# EAGLE design ZOMGTHEREMINBBQLOL.3 (EAGLE 5.11)

## Sheet 1 of 2
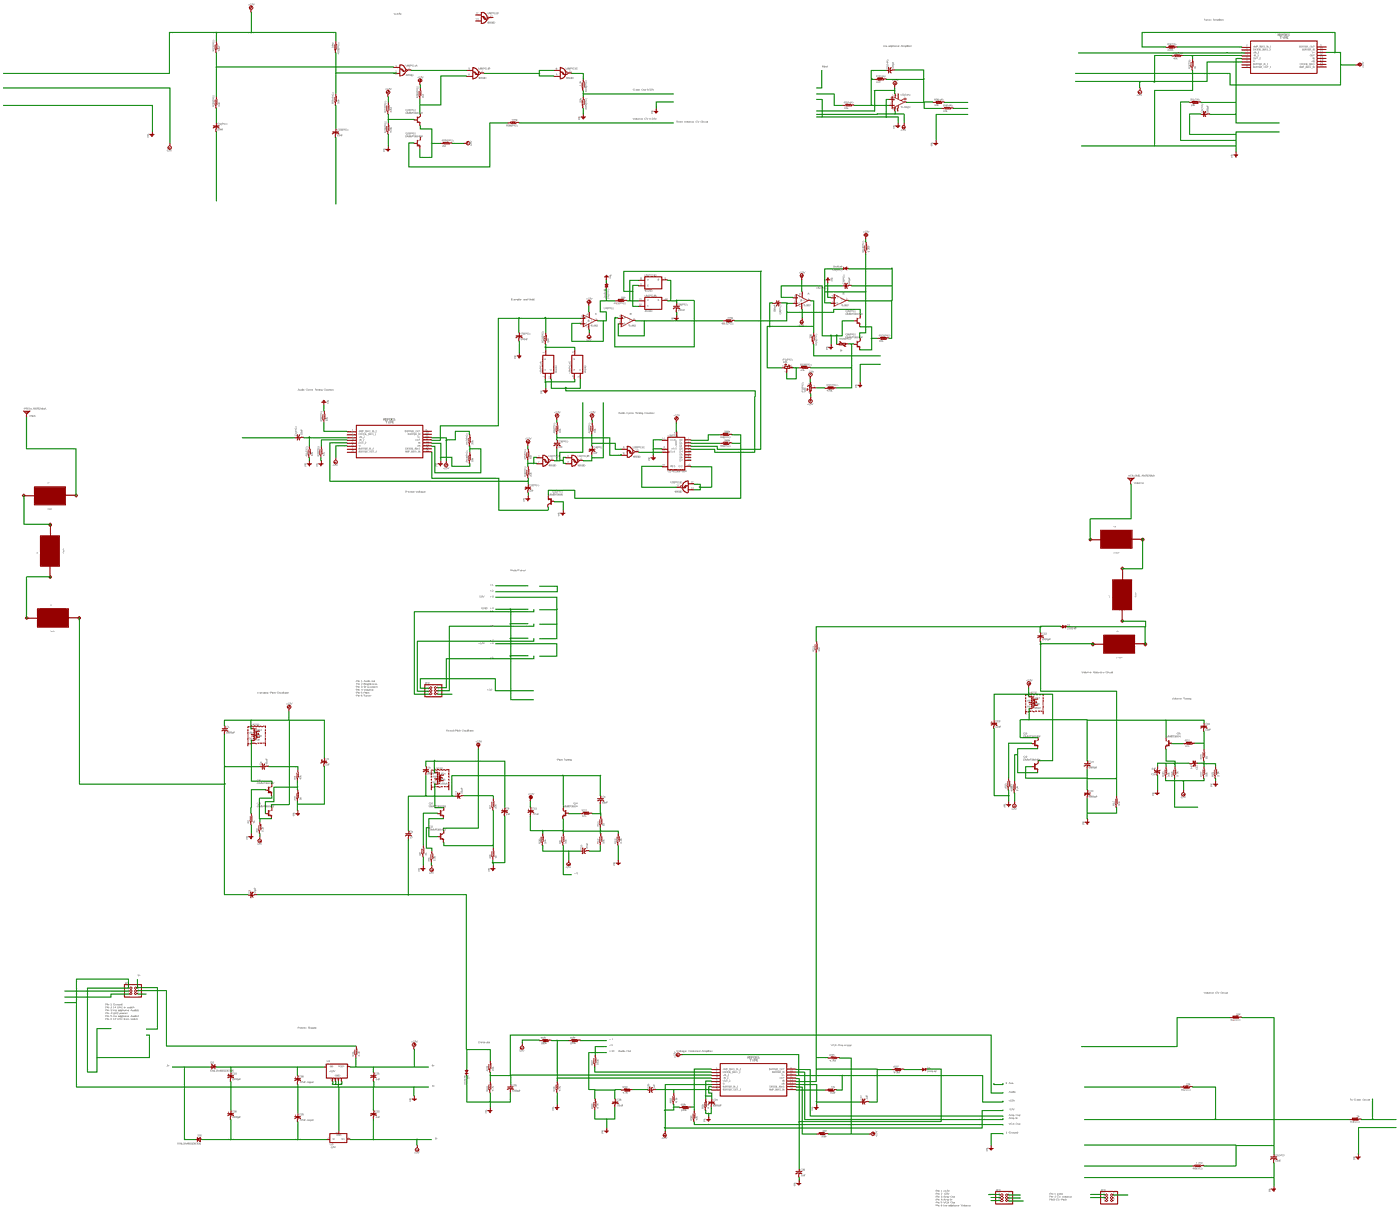
[diagram p0: schematic, sheet 1, overview]
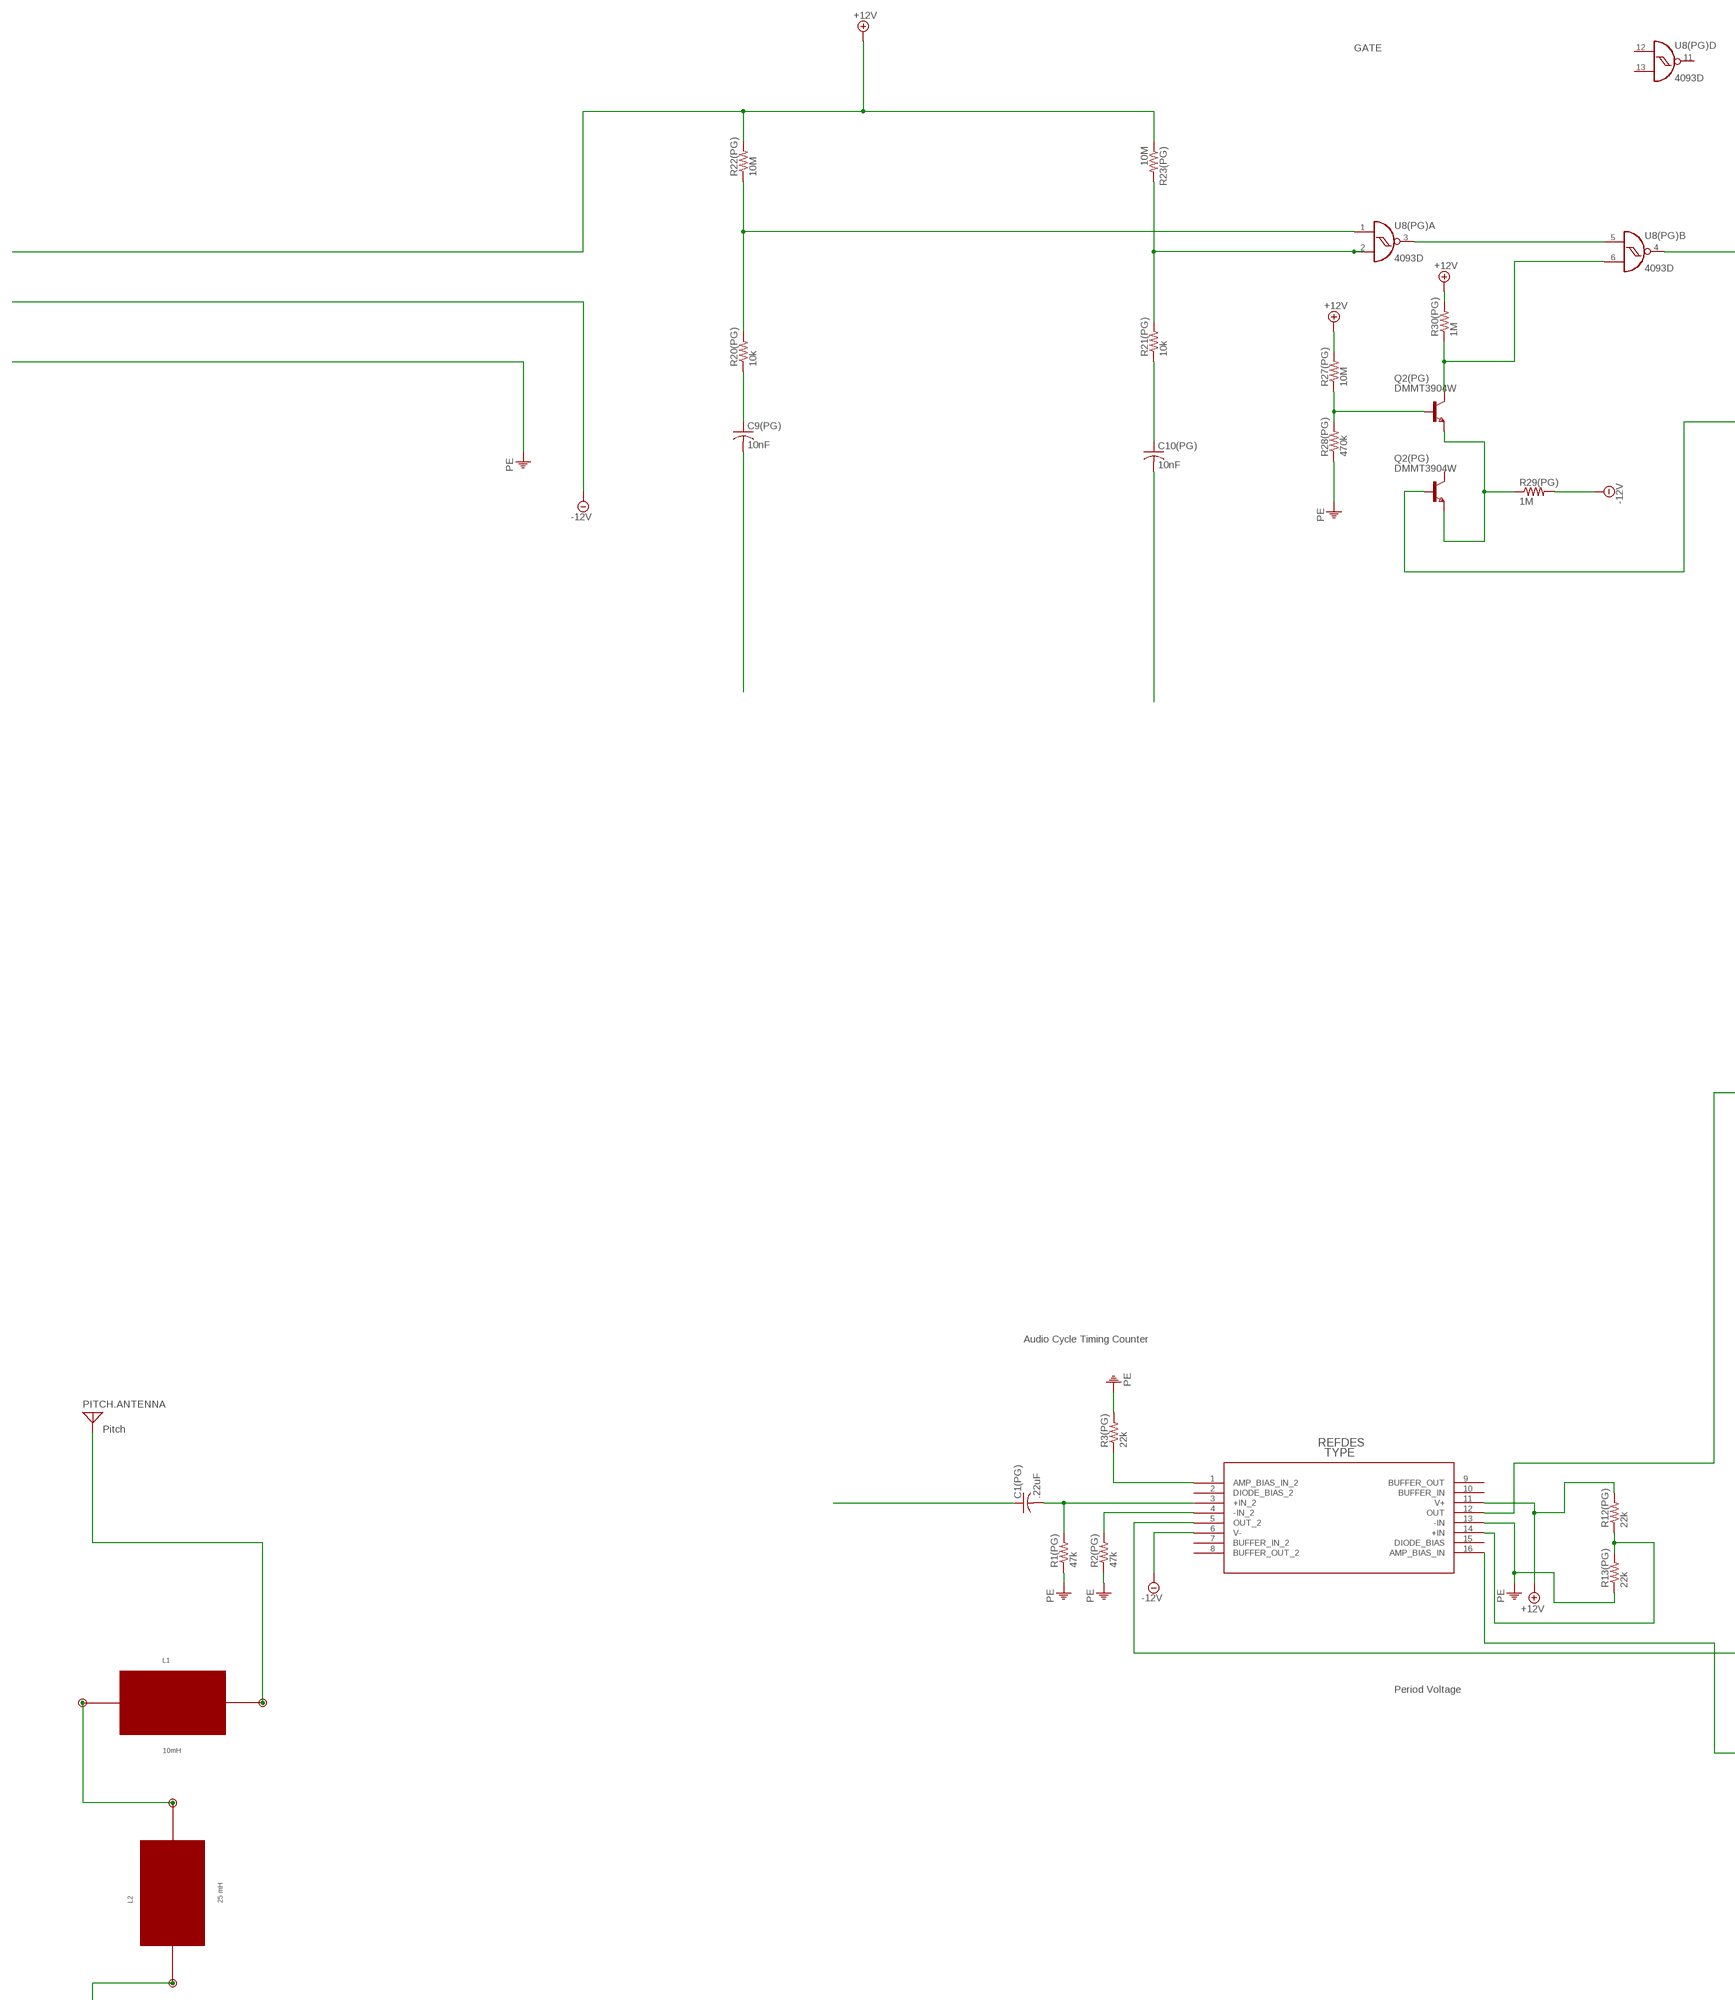
[diagram p1: schematic, sheet 1, part 1 of 6]
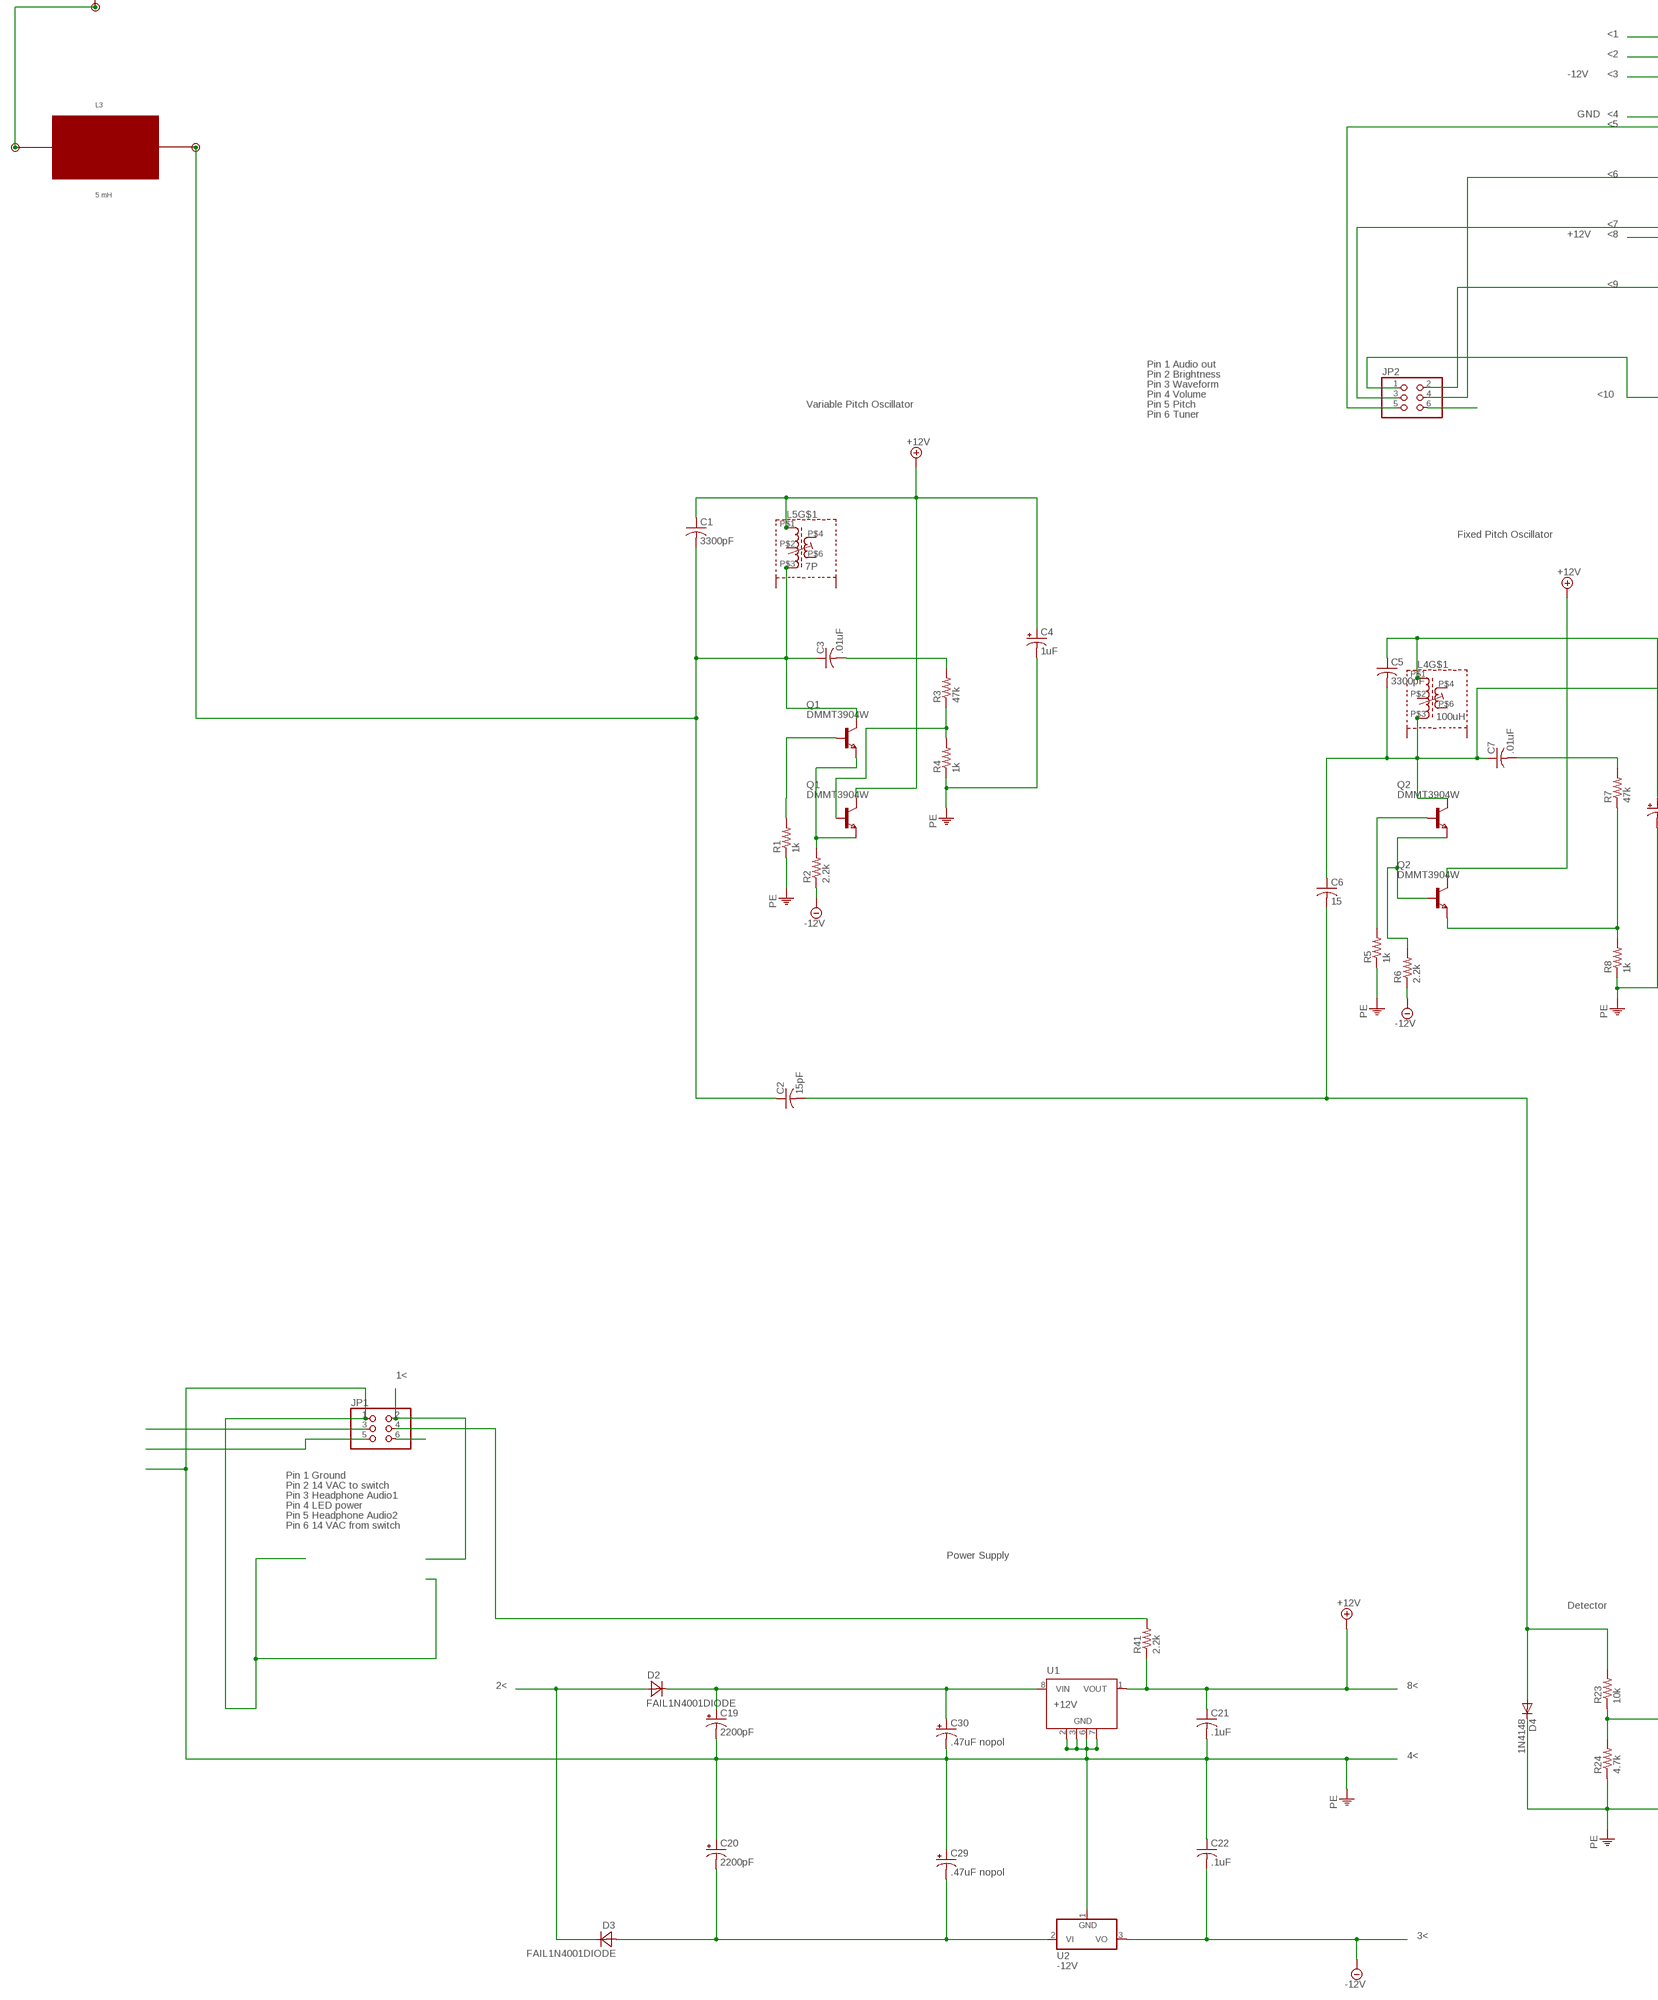
[diagram p2: schematic, sheet 1, part 2 of 6]
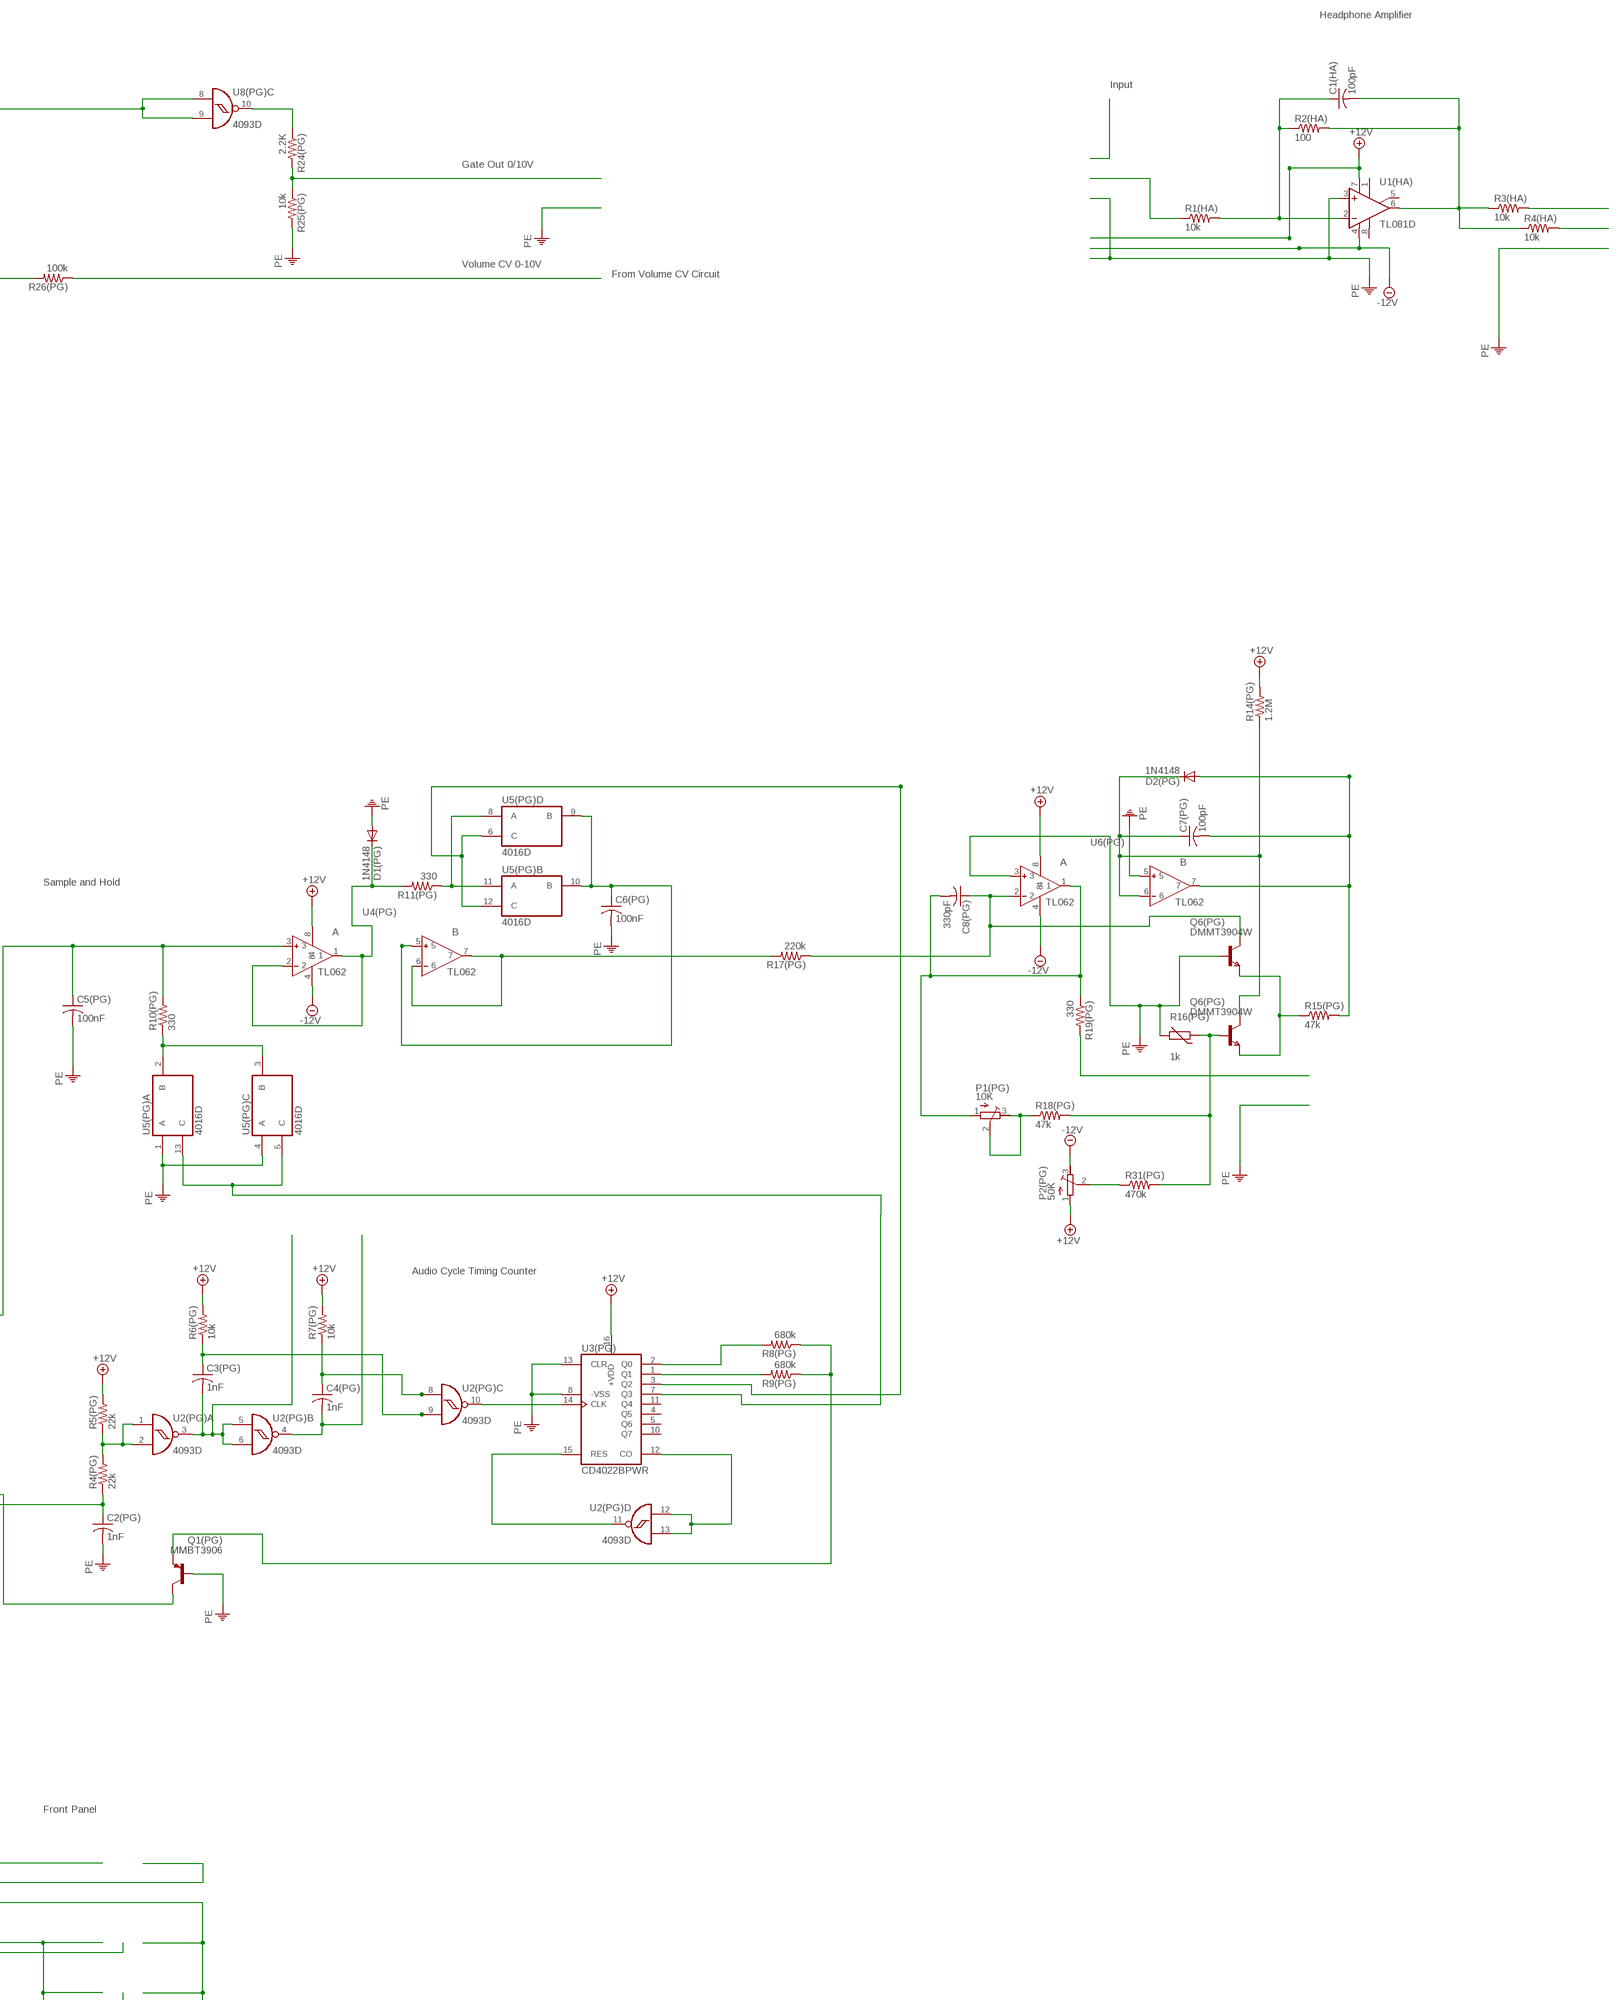
[diagram p3: schematic, sheet 1, part 3 of 6]
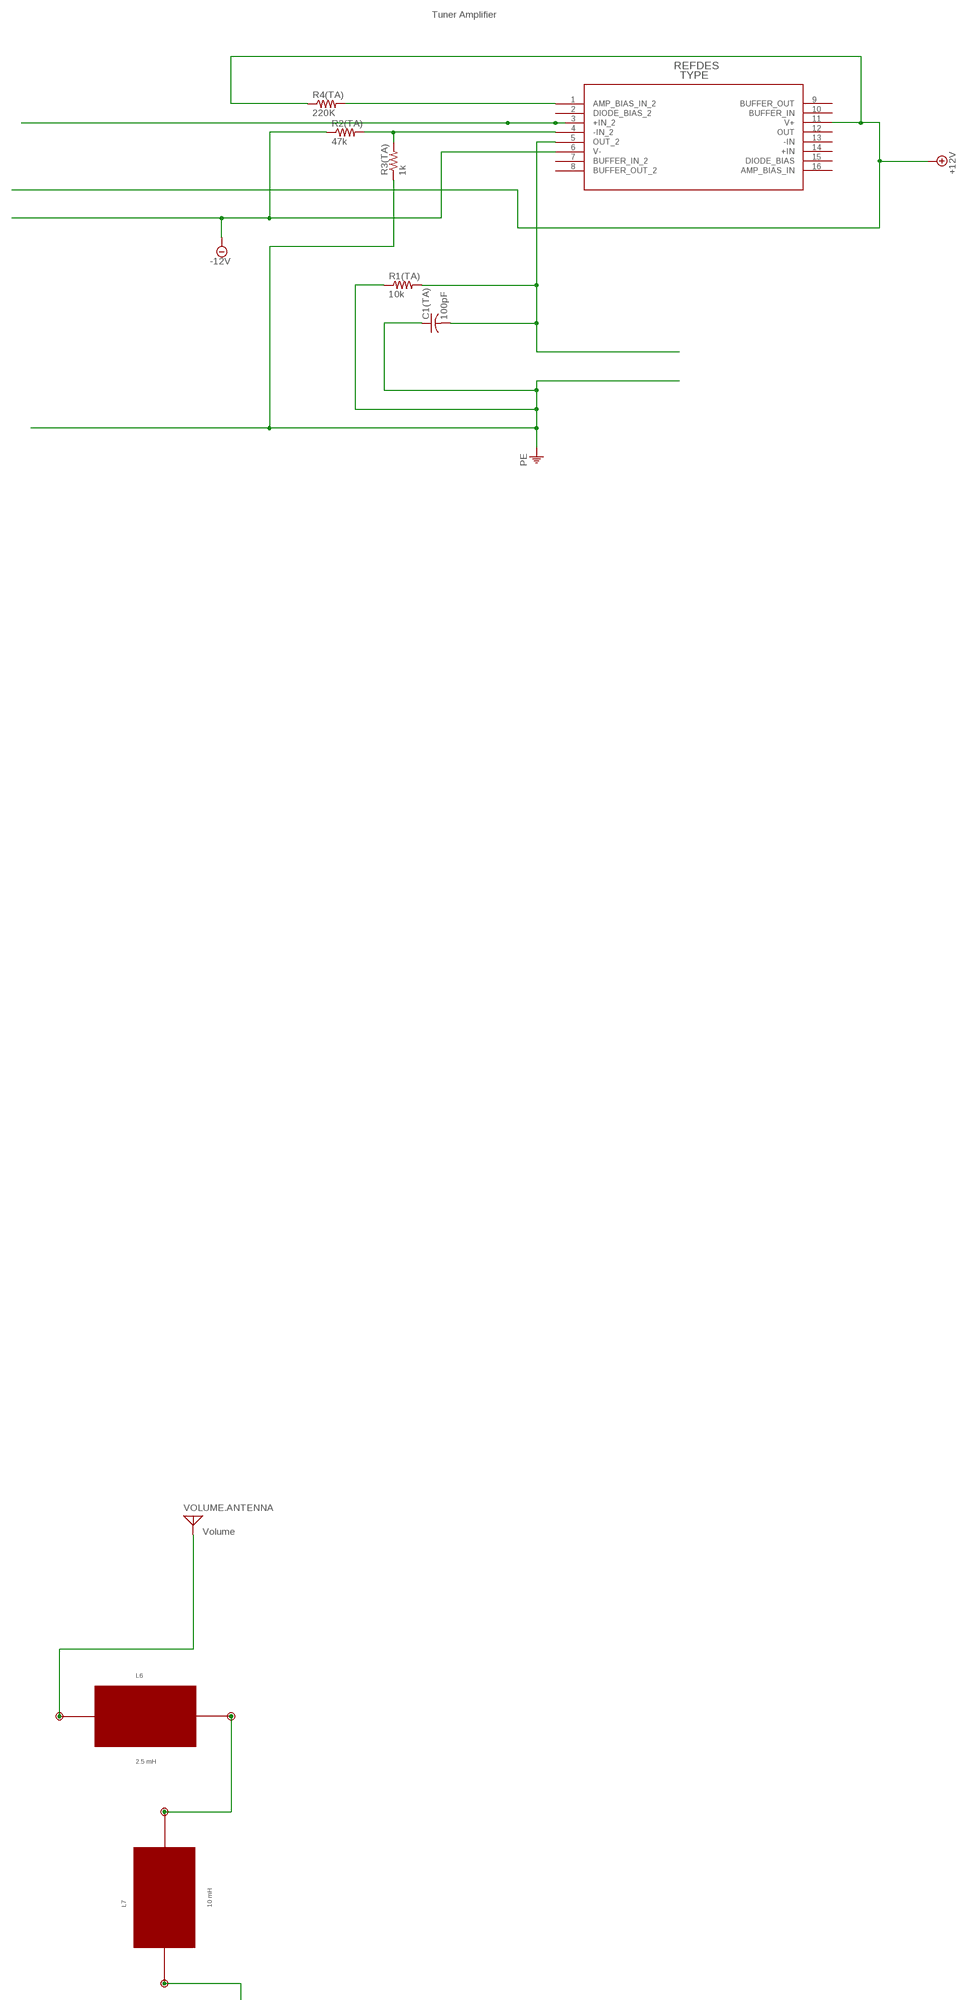
[diagram p4: schematic, sheet 1, part 4 of 6]
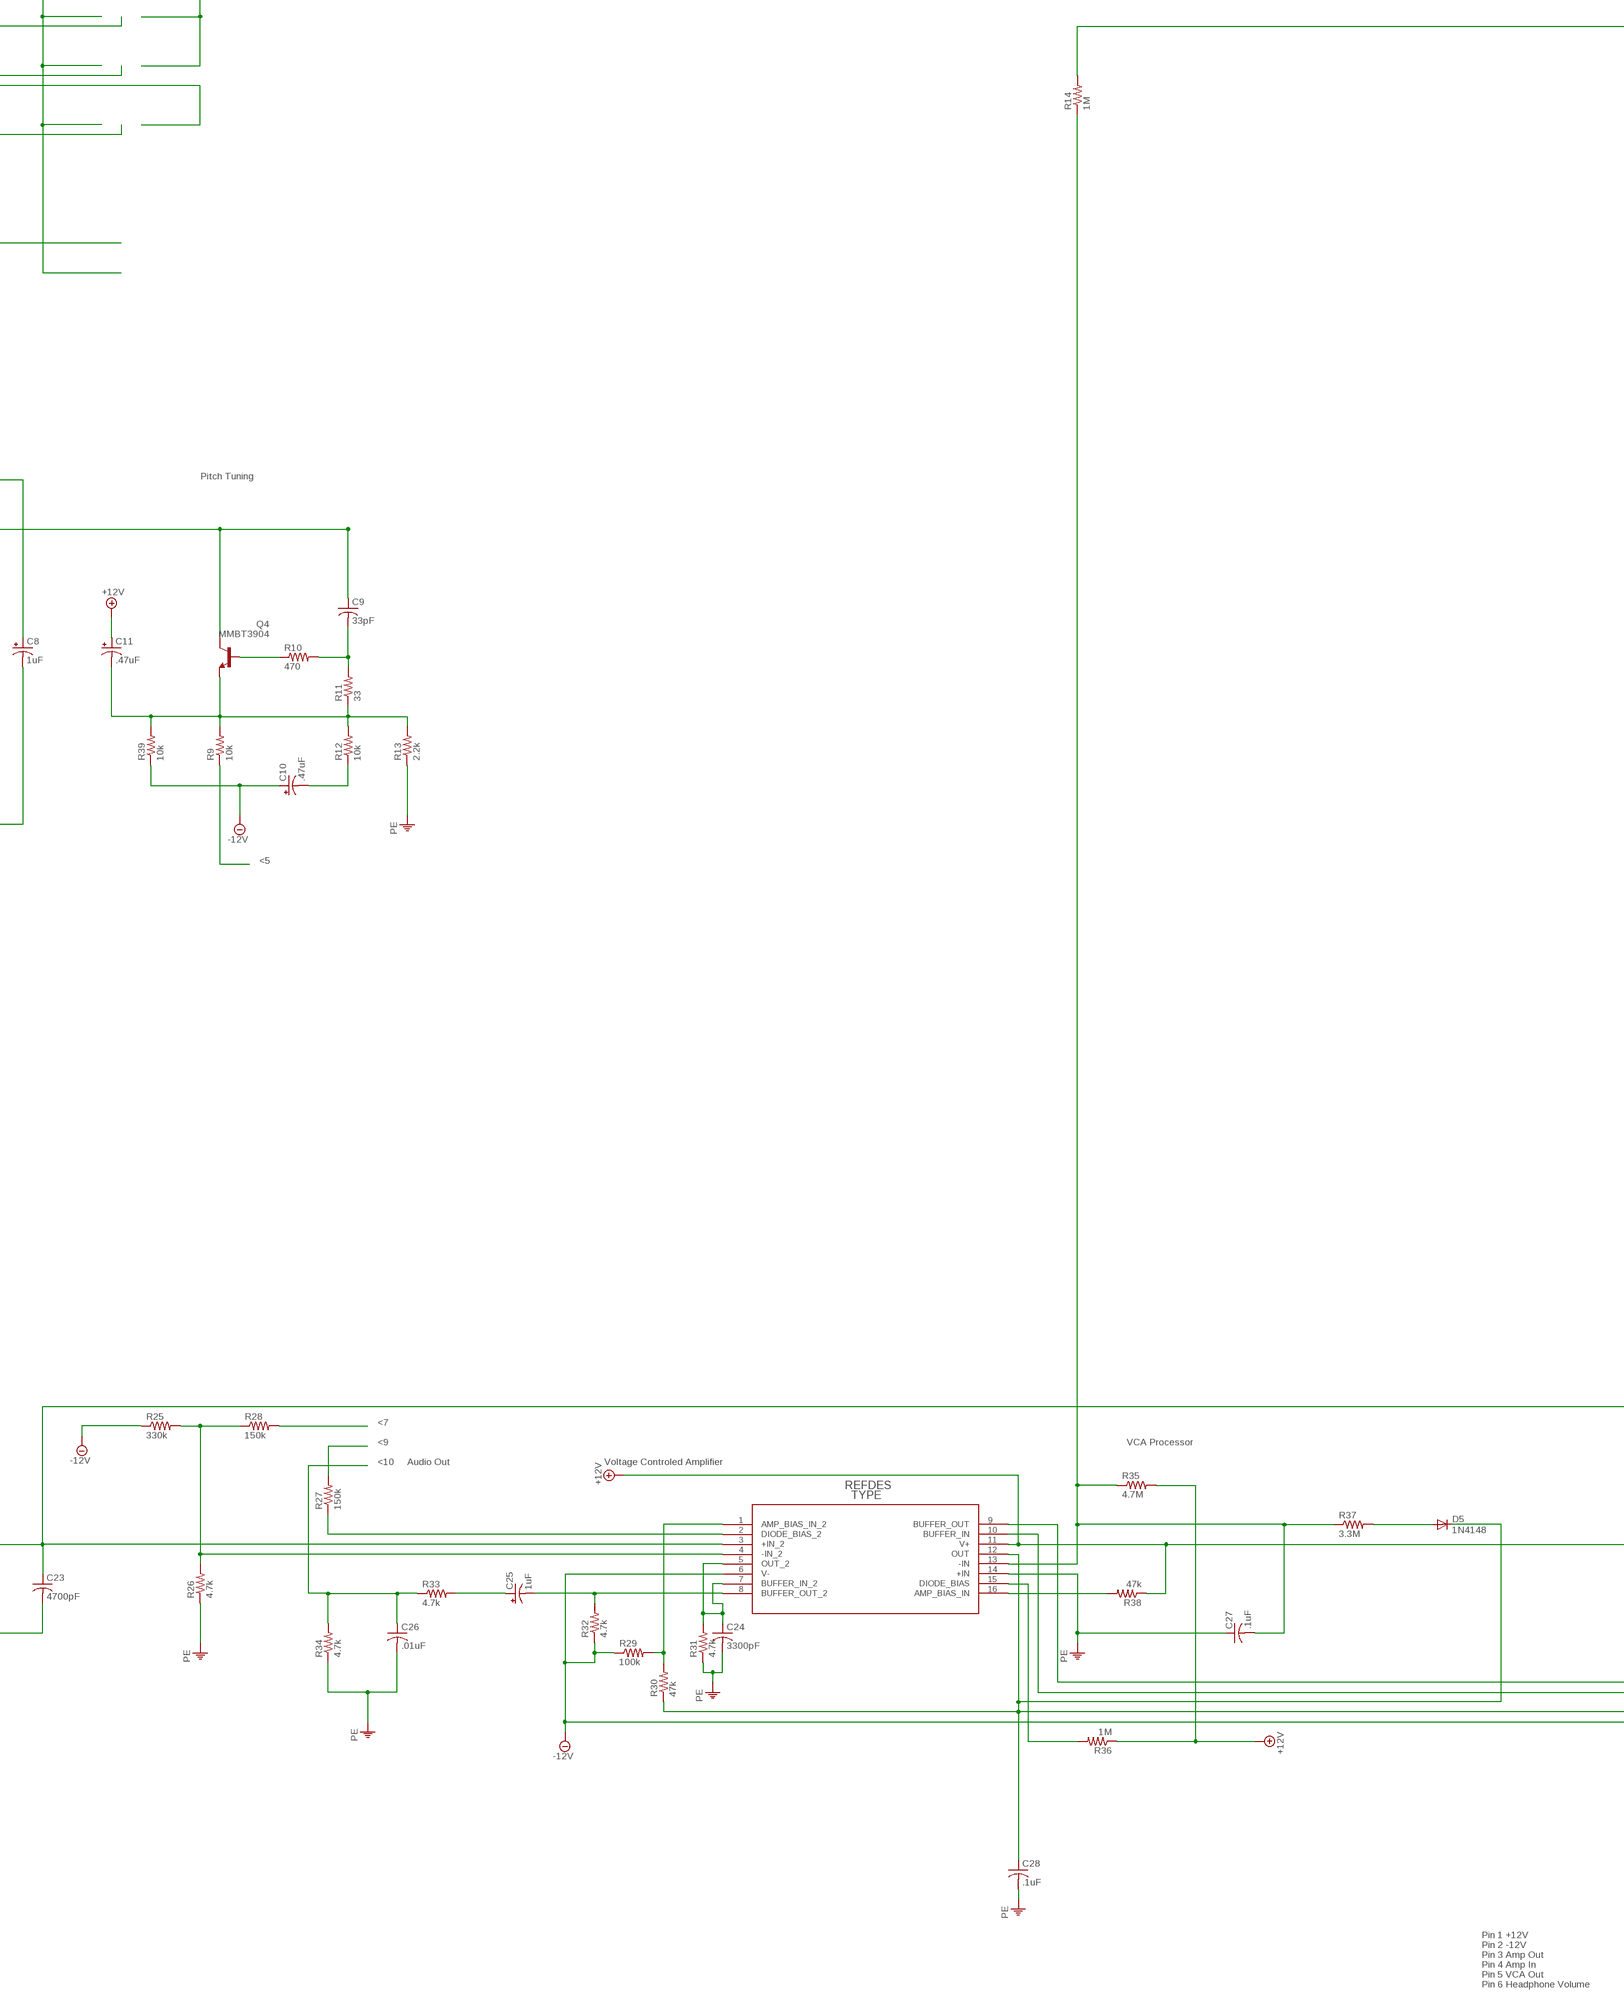
[diagram p5: schematic, sheet 1, part 5 of 6]
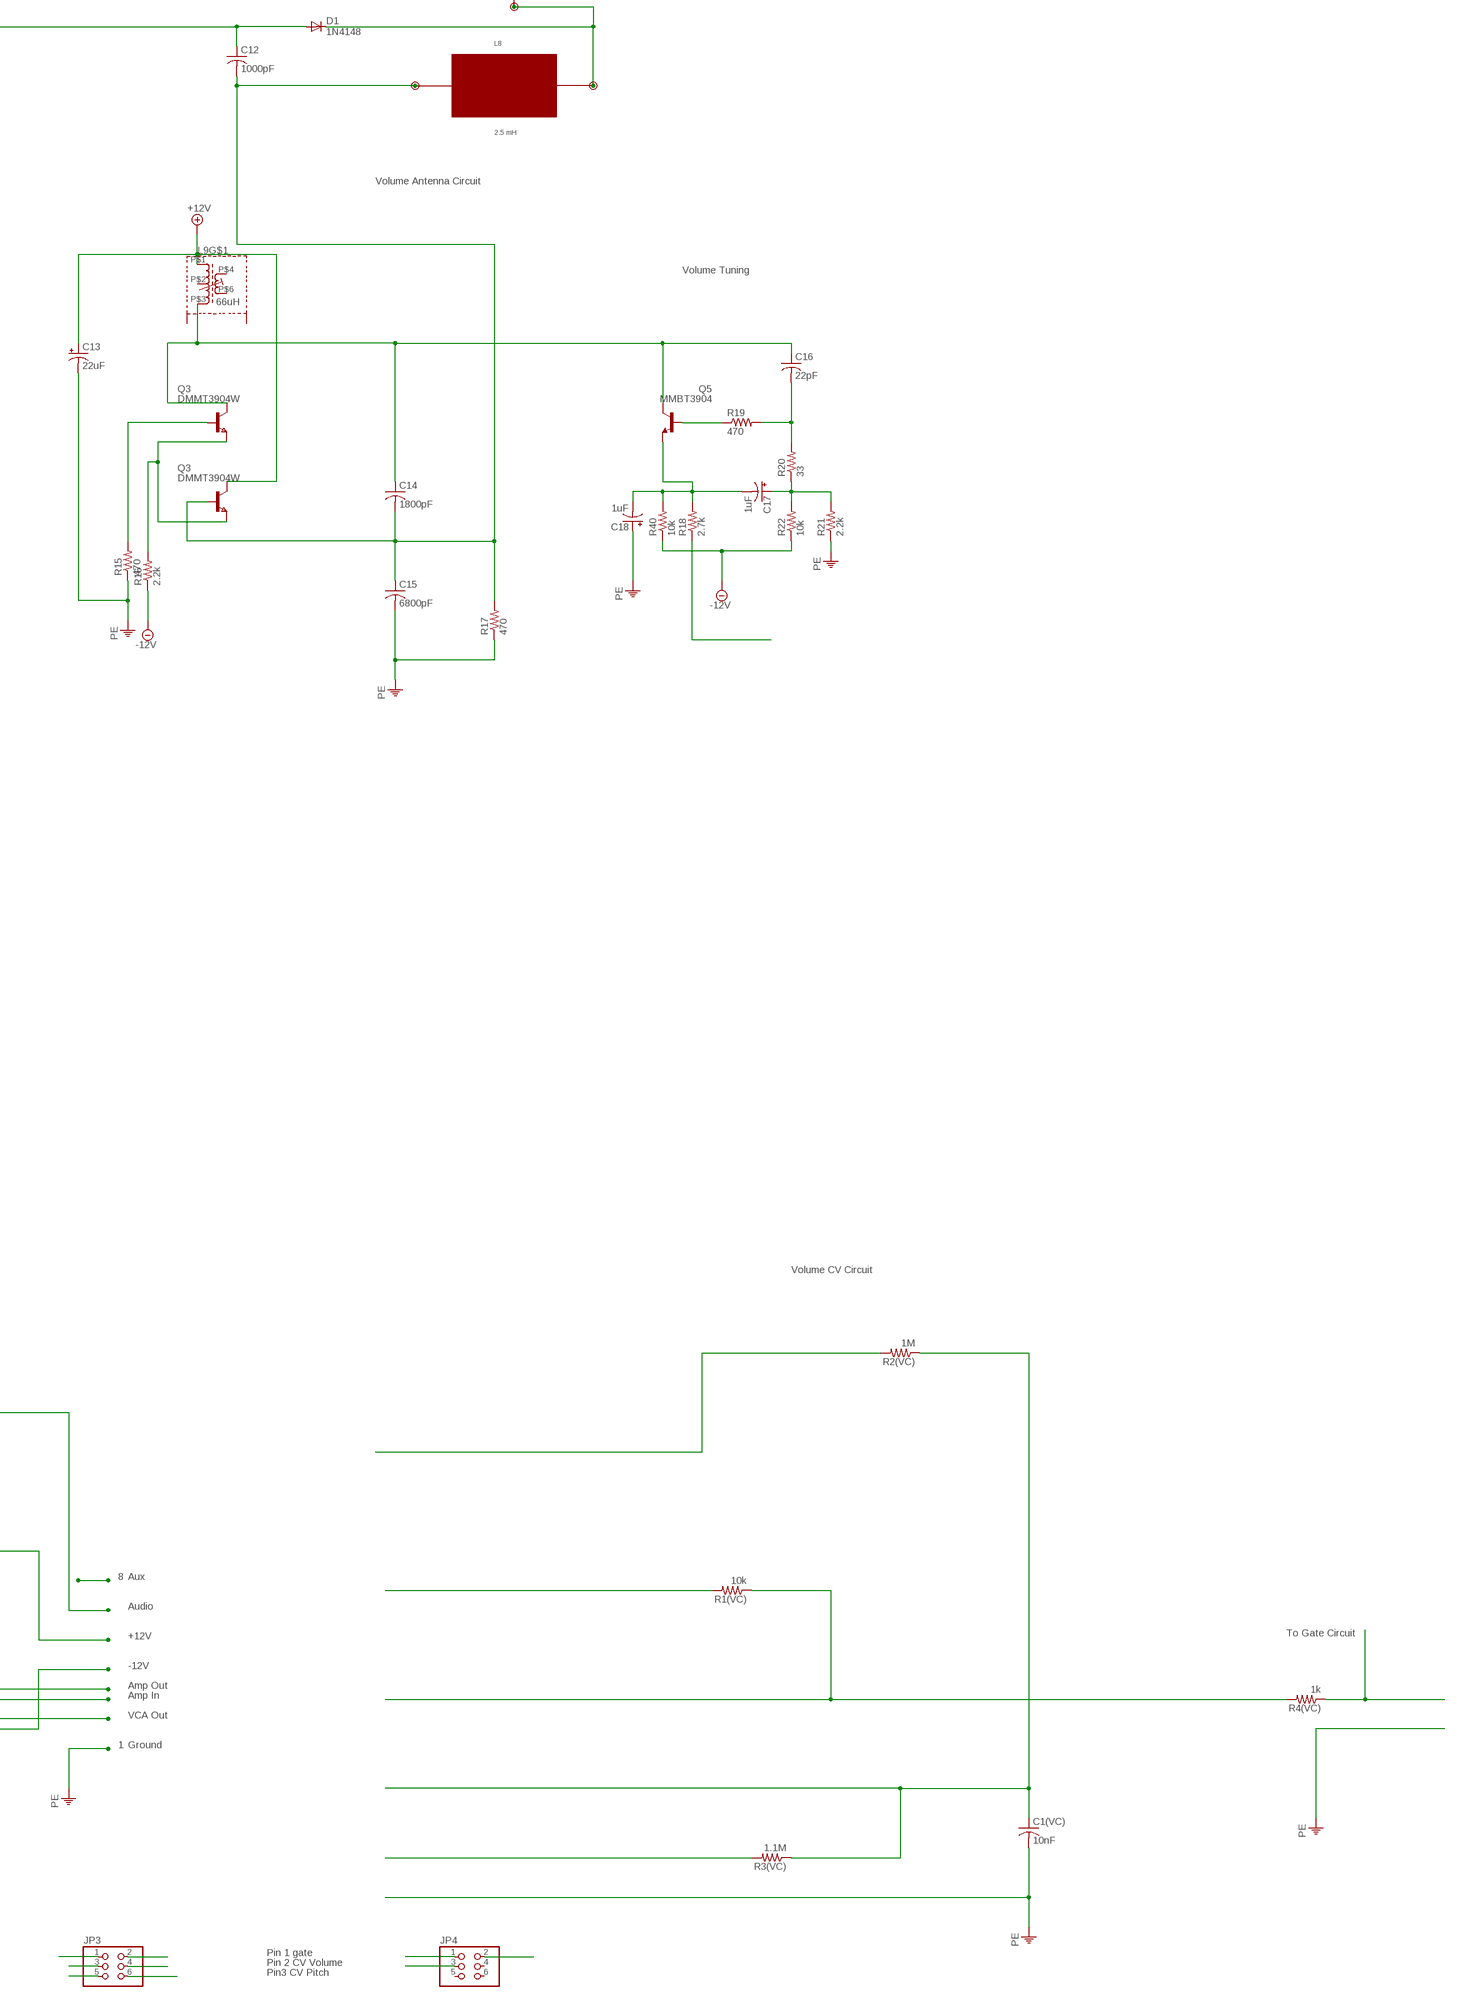
[diagram p6: schematic, sheet 1, part 6 of 6]

### Parts
C1  3300pF  23PRADIALSTYRENE  [23PRADIALSTYRENE]
C1(HA)  100pF  C-USC0805  [C0805]
C1(PG)  .22uF  C-USC1206  [C1206]
C1(TA)  100pF  C-USC0805  [C0805]
C1(VC)  10nF  C-USC0805  [C0805]
C2  15pF  C-USC0805  [C0805]
C2(PG)  1nF  C-USC0805  [C0805]
C3  .01uF  XYPOLYESTERCAP  [XYPOLYESTERCAP]
C3(PG)  1nF  C-USC0805  [C0805]
C4  1uF  CPOL-USC/6032-28R  [C/6032-28R]
C4(PG)  1nF  C-USC0805  [C0805]
C5  3300pF  23PRADIALSTYRENE  [23PRADIALSTYRENE]
C5(PG)  100nF  C-USC0805  [C0805]
C6  15  C-USC0805  [C0805]
C6(PG)  100nF  C-USC0805  [C0805]
C7  .01uF  XYPOLYESTERCAP  [XYPOLYESTERCAP]
C7(PG)  100pF  C-USC0805  [C0805]
C8  1uF  CPOL-USC/6032-28R  [C/6032-28R]
C8(PG)  330pF  C-USC0805  [C0805]
C9  33pF  C-USC0805  [C0805]
C9(PG)  10nF  C-USC0805  [C0805]
C10  .47uF  CPOL-USA/3216-18R  [A/3216-18R]
C10(PG)  10nF  C-USC0805  [C0805]
C11  .47uF  CPOL-USA/3216-18R  [A/3216-18R]
C12  1000pF  C-USC0805  [C0805]
C13  22uF  CPOL-USD/7343-31R  [D/7343-31R]
C14  1800pF  23PSTYRENE  [23PSTYRENE]
C15  6800pF  POLYESTERCAP  [POLYESTERCAP]
C16  22pF  C-USC0805  [C0805]
C17  1uF  CPOL-USC/6032-28R  [C/6032-28R]
C18  1uF  CPOL-USC/6032-28R  [C/6032-28R]
C19  2200pF  CAP_POLPTH4  [CPOL-RADIAL-1000UF-25V]
C20  2200pF  CAP_POLPTH4  [CPOL-RADIAL-1000UF-25V]
C21  .1uF  C-USC0805  [C0805]
C22  .1uF  C-USC0805  [C0805]
C23  4700pF  C-USC0805  [C0805]
C24  3300pF  C-USC0805  [C0805]
C25  1uF  CPOL-USC/6032-28R  [C/6032-28R]
C26  .01uF  XYPOLYESTERCAP  [XYPOLYESTERCAP]
C27  .1uF  C-USC0805  [C0805]
C28  .1uF  C-USC0805  [C0805]
C29  .47uF nopol  CPOL-USA/3216-18R  [A/3216-18R]
C30  .47uF nopol  CPOL-USA/3216-18R  [A/3216-18R]
D1  1N4148  1N4148DO35-10  [DO35-10]
D1(PG)  1N4148  1N4148DO35-10  [DO35-10]
D2  FAIL1N4001DIODE  [FAIL1N4001DIODE]
D2(PG)  1N4148  1N4148DO35-10  [DO35-10]
D3  FAIL1N4001DIODE  [FAIL1N4001DIODE]
D4  1N4148  1N4148DO35-10  [DO35-10]
D5  1N4148  1N4148DO35-10  [DO35-10]
JP1  PINHD-2X3  [2X03]
JP2  PINHD-2X3  [2X03]
JP3  PINHD-2X3  [2X03]
JP4  PINHD-2X3  [2X03]
L1  10mH  6300.CHOKES  [6300.CHOKES]
L2  25 mH  6300.CHOKES  [6300.CHOKES]
L3  5 mH  6300.CHOKES  [6300.CHOKES]
L4  100uH  7P  [7P]
L5  7P  [7P]
L6  2.5 mH  6300.CHOKES  [6300.CHOKES]
L7  10 mH  6300.CHOKES  [6300.CHOKES]
L8  2.5 mH  6300.CHOKES  [6300.CHOKES]
L9  66uH  10K  [10K]
P1(PG)  10K  3299Y  [3299Y]
P2(PG)  50K  3299Y  [3299Y]
PITCH.ANTENNA  Pitch  ANTENNA  [PAD-01]
Q1  DMMT3904W  [SOT363]
Q1(PG)  MMBT3906  [SOT23]
Q2  DMMT3904W  [SOT363]
Q2(PG)  DMMT3904W  [SOT363]
Q3  DMMT3904W  [SOT363]
Q4  MMBT3904  [SOT23]
Q5  MMBT3904  [SOT23]
Q6(PG)  DMMT3904W  [SOT363]
R1  1k  R-US_R0805  [R0805]
R1(HA)  10k  RESISTOR1206  [1206]
R1(PG)  47k  R-US_R0805  [R0805]
R1(TA)  10k  RESISTOR1206  [1206]
R1(VC)  10k  R-US_R0805  [R0805]
R2  2.2k  R-US_R0805  [R0805]
R2(HA)  100  RESISTOR1206  [1206]
R2(PG)  47k  R-US_R0805  [R0805]
R2(TA)  47k  RESISTOR1206  [1206]
R2(VC)  1M  R-US_R0805  [R0805]
R3  47k  R-US_R0805  [R0805]
R3(HA)  10k  RESISTOR1206  [1206]
R3(PG)  22k  R-US_R0805  [R0805]
R3(TA)  1k  RESISTOR1206  [1206]
R3(VC)  1.1M  R-US_R0805  [R0805]
R4  1k  R-US_R0805  [R0805]
R4(HA)  10k  RESISTOR1206  [1206]
R4(PG)  22k  R-US_R0805  [R0805]
R4(TA)  220K  RESISTOR1206  [1206]
R4(VC)  1k  R-US_R0805  [R0805]
R5  1k  R-US_R0805  [R0805]
R5(PG)  22k  R-US_R0805  [R0805]
R6  2.2k  R-US_R0805  [R0805]
R6(PG)  10k  R-US_R0805  [R0805]
R7  47k  R-US_R0805  [R0805]
R7(PG)  10k  R-US_R0805  [R0805]
R8  1k  R-US_R0805  [R0805]
R8(PG)  680k  R-US_R0805  [R0805]
R9  10k  R-US_R0805  [R0805]
R9(PG)  680k  R-US_R0805  [R0805]
R10  470  R-US_R0805  [R0805]
R10(PG)  330  R-US_R0805  [R0805]
R11  33  R-US_R0805  [R0805]
R11(PG)  330  R-US_R0805  [R0805]
R12  10k  R-US_R0805  [R0805]
R12(PG)  22k  R-US_R0805  [R0805]
R13  2.2k  R-US_R0805  [R0805]
R13(PG)  22k  R-US_R0805  [R0805]
R14  1M  RESISTOR1206  [1206]
R14(PG)  1.2M  RESISTOR1206  [1206]
R15  470  R-US_R0805  [R0805]
R15(PG)  47k  R-US_R0805  [R0805]
R16  2.2k  R-US_R0805  [R0805]
R16(PG)  1k  LT1/4LT52R102J3900  [LT1/4LT52R102J3900]
R17  470  R-US_R0805  [R0805]
R17(PG)  220k  R-US_R0805  [R0805]
R18  2.7k  R-US_R0805  [R0805]
R18(PG)  47k  R-US_R0805  [R0805]
R19  470  R-US_R0805  [R0805]
R19(PG)  330  R-US_R0805  [R0805]
R20  33  R-US_R0805  [R0805]
R20(PG)  10k  R-US_R0805  [R0805]
R21  2.2k  R-US_R0805  [R0805]
R21(PG)  10k  R-US_R0805  [R0805]
R22  10k  R-US_R0805  [R0805]
R22(PG)  10M  RESISTOR1206  [1206]
R23  10k  R-US_R0805  [R0805]
R23(PG)  10M  RESISTOR1206  [1206]
R24  4.7k  R-US_R0805  [R0805]
R24(PG)  2.2K  R-US_R0805  [R0805]
R25  330k  R-US_R0805  [R0805]
R25(PG)  10k  R-US_R0805  [R0805]
R26  4.7k  R-US_R0805  [R0805]
R26(PG)  100k  R-US_R0805  [R0805]
R27  150k  R-US_R0805  [R0805]
R27(PG)  10M  RESISTOR1206  [1206]
R28  150k  R-US_R0805  [R0805]
R28(PG)  470k  R-US_R0805  [R0805]
R29  100k  R-US_R0805  [R0805]
R29(PG)  1M  RESISTOR1206  [1206]
R30  47k  R-US_R0805  [R0805]
R30(PG)  1M  RESISTOR1206  [1206]
R31  4.7k  R-US_R0805  [R0805]
R31(PG)  470k  R-US_R0805  [R0805]
R32  4.7k  R-US_R0805  [R0805]
R33  4.7k  R-US_R0805  [R0805]
R34  4.7k  R-US_R0805  [R0805]
R35  4.7M  RESISTOR1206  [1206]
R36  1M  RESISTOR1206  [1206]
R37  3.3M  RESISTOR1206  [1206]
R38  47k  R-US_R0805  [R0805]
R39  10k  R-US_R0805  [R0805]
R40  10k  R-US_R0805  [R0805]
R41  2.2k  R-US_R0805  [R0805]
U1  +12V  78L12SMD  [SO08]
U1(HA)  TL081D  [SO08]
U1(PG)  LM13700M  [M16A]
U1(TA)  LM13700M  [M16A]
U2  -12V  L7912CD2T  [DDPAK]
U2(PG)  4093D  [SO14]
U3  LM13700M  [M16A]
U3(PG)  CD4022BPWR  [TSSOP16]
U4(PG)  TL062  [SO8]
U5(PG)  4016D  [SO14]
U6(PG)  TL062  [SO8]
U8(PG)  4093D  [SO14]
VOLUME.ANTENNA  Volume  ANTENNA  [PAD-01]

### Nets
3: C1(VC).1 JP3.4 R2(VC).1 R3(VC).1 U3.10(BUFFER_IN)
4: JP3.3 R1(VC).1 R4(VC).2 U3.9(BUFFER_OUT)
7: C1(PG).1 C23.1 R23.1 R24.2 U1(TA).3(+IN_2) U3.3(+IN_2)
+12V: C1.P$1 C4.+ C11.+ C13.+ C21.1 JP3.1 L5.P$1(A1) L9.P$1(A1) P2(PG).1(E) Q1.P$6(C1) Q2.P$6(C1) Q3.P$6(C1) R2(VC).2 R4(TA).1 R5(PG).2 R6(PG).2 R7(PG).2 R12(PG).2 R14(PG).2 R22(PG).2 R23(PG).1 R27(PG).2 R30(PG).2 R35.2 R36.1 R38.1 R41.1 U1(HA).7(V+) U1(PG).11(V+) U1(TA).11(V+) U1.1(VOUT) U3(PG).16(+VDD) U3.11(V+) U4(PG).8 U6(PG).8
-12V: C10.+ C22.2 JP3.2 P2(PG).3(A) R1(VC).2 R2(TA).1 R2.1 R6.1 R16.1 R22.1 R25.1 R29(PG).2 R29.1 R32.1 R39.1 R40.1 U1(HA).4(V-) U1(PG).6(V-) U1(TA).6(V-) U2.3(VO) U3.6(V-) U4(PG).4 U6(PG).4
<1: JP1.2
<2: D2.A D3.C JP1.6
<5: JP2.5 R9.1
<6: JP2.4 R18.1
<7: JP2.3 R28.2
<9: JP2.2 R27.2
<10: C26.P$1 JP2.1 R33.1 R34.2
D1(PG): D1(PG).C R11(PG).2 U4(PG).1 U4(PG).2
G1: C3(PG).2 C9(PG).2 U2(PG).3(A:O) U2(PG).5(B:I0) U2(PG).6(B:I1)
G2: C4(PG).2 C10(PG).2 U2(PG).4(B:O)
GATE: JP4.1 R24(PG).2 R25(PG).1
HEADPHONE1: JP1.3 R3(HA).2
HEADPHONE2: JP1.5 R4(HA).2
HEADPHONEVOL: JP3.6 R1(HA).1
N$1: C2.2 C6.2 D4.A R23.2
N$2: R25.2 R26.2 R28.1 U3.4(-IN_2)
N$3: C19.1(+) C30.+ D2.C U1.8(VIN)
N$4: C20.2(-) C29.- D3.A U2.2(VI)
N$5: U2(PG).10(C:O) U3(PG).14(CLK)
N$6: C24.1 R31.2 U3.5(OUT_2) U3.7(BUFFER_IN_2)
N$8: C25.+ R33.2
N$9: R29.2 R30.2 U3.1(AMP_BIAS_IN_2)
N$10: D5.A R37.2
N$11: R20(PG).2 R22(PG).1 U8(PG).1(A:I0)
N$12: JP1.4 R41.2
N$13: C25.- R32.2 U3.8(BUFFER_OUT_2)
N$15: R4(TA).2 U1(TA).1(AMP_BIAS_IN_2)
N$16: C1.P$2 C2.1 C3.P$1 L3.2 L5.P$3(E1) Q1.P$3(C)
N$17: C27.2 R14.1 R35.1 R37.1 U3.13(-IN)
N$18: R36.2 U3.15(DIODE_BIAS)
N$19: L1.1 L2.2
N$20: R38.2 U3.16(AMP_BIAS_IN)
N$21: L2.1 L3.1
N$22: L1.2 PITCH.ANTENNA.1
N$23: L6.1 VOLUME.ANTENNA.1
N$24: L6.2 L7.2
N$25: D1.C L7.1 L8.2
N$26: Q1.P$2(B1) R3.1 R4.2
N$27: C12.1 D1.A R14.2
N$28: C16.2 R19.2 R20.2
N$29: C3.P$2 R3.2
N$30: C5.P$2 C6.1 C7.P$1 C9.1 L4.P$3(E1) Q2.P$3(C) Q4.3(C)
N$31: Q1.P$1(B) R1.2
N$32: Q2.P$1(B) R5.2
N$33: Q1.P$4(E) Q1.P$5(E1) R2.2
N$34: C5.P$1 C8.+ L4.P$1(A1)
N$35: C7.P$2 R7.2
N$36: Q2.P$2(B1) Q2.P$4(E) R6.2
N$37: C10.- R12.1
N$38: Q2.P$5(E1) R7.1 R8.2
N$39: Q4.1(B) R10.1
N$40: R27.1 U3.2(DIODE_BIAS_2)
N$41: C9.2 R10.2 R11.2
N$42: C11.- Q4.2(E) R9.2 R11.1 R12.2 R13.2 R39.2
N$43: Q3.P$4(E) Q3.P$5(E1) R16.2
N$44: C12.2 C14.P$2 C15.P$1 L8.1 Q3.P$2(B1) R17.2
N$45: Q3.P$1(B) R15.2
N$46: C14.P$1 C16.1 L9.P$3(E1) Q3.P$3(C) Q5.3(C)
N$47: Q5.1(B) R19.1
N$48: C17.+ R20.1 R21.2 R22.2
N$49: R2(TA).2 R3(TA).2 U1(TA).4(-IN_2)
N$51: R21(PG).2 R23(PG).2 U8(PG).2(A:I1)
N$52: C9(PG).1 R20(PG).1
N$53: C17.- C18.- Q5.2(E) R18.2 R40.2
N$54: C1(HA).1 R1(HA).2 R2(HA).1 U1(HA).2(-IN)
N$55: C10(PG).1 R21(PG).1
N$56: C1(HA).2 R2(HA).2 R3(HA).1 R4(HA).1 U1(HA).6(OUT)
N$59: U8(PG).3(A:O) U8(PG).5(B:I0)
N$60: Q2(PG).P$3(C) R30(PG).1 U8(PG).6(B:I1)
N$61: U2(PG).11(D:O) U3(PG).15(RES)
N$62: Q2(PG).P$1(B) R27(PG).1 R28(PG).2
N$63: Q2(PG).P$4(E) Q2(PG).P$5(E1) R29(PG).1
N$64: Q2(PG).P$2(B1) R26(PG).2
N$65: U8(PG).4(B:O) U8(PG).8(C:I0) U8(PG).9(C:I1)
N$66: R24(PG).1 U8(PG).10(C:O)
N$68: U2(PG).12(D:I0) U2(PG).13(D:I1) U3(PG).12(CO)
N$69: C1(PG).2 R1(PG).2 U1(PG).3(+IN_2)
N$70: Q1(PG).3(C) U1(PG).16(AMP_BIAS_IN)
N$71: R2(PG).2 U1(PG).4(-IN_2)
N$72: R3(PG).1 U1(PG).1(AMP_BIAS_IN_2)
N$73: R12(PG).1 R13(PG).2 U1(PG).14(+IN)
N$74: C5(PG).1 R10(PG).2 U1(PG).12(OUT) U4(PG).3
N$75: R4(PG).2 R5(PG).1 U2(PG).1(A:I0) U2(PG).2(A:I1)
N$76: C2(PG).1 R4(PG).1 U1(PG).5(OUT_2)
N$77: C3(PG).1 R6(PG).1 U2(PG).9(C:I1)
N$78: C4(PG).1 R7(PG).1 U2(PG).8(C:I0)
N$79: R8(PG).2 U3(PG).2(Q0)
N$81: R10(PG).1 U5(PG).2(A:B) U5(PG).3(C:B)
N$82: R9(PG).2 U3(PG).1(Q1)
N$83: C6(PG).1 U4(PG).5 U5(PG).9(D:B) U5(PG).10(B:B)
N$84: R11(PG).1 U5(PG).8(D:A) U5(PG).11(B:A)
N$85: Q1(PG).2(E) R8(PG).1 R9(PG).1
N$86: U3(PG).7(Q3) U5(PG).5(C:C) U5(PG).13(A:C)
N$87: C8(PG).1 Q6(PG).P$3(C) R17(PG).1 U6(PG).2
N$88: R17(PG).2 U4(PG).6 U4(PG).7
N$89: U3(PG).3(Q2) U5(PG).6(D:C) U5(PG).12(B:C)
N$90: P2(PG).2(S) R31(PG).1
N$93: P1(PG).2(S) P1(PG).3(A) R18(PG).1
N$94: Q6(PG).P$4(E) Q6(PG).P$5(E1) R15(PG).1
N$95: C7(PG).2 D2(PG).A R15(PG).2 U6(PG).7
N$96: C7(PG).1 D2(PG).C Q6(PG).P$6(C1) R14(PG).1 U6(PG).6
N$97: Q6(PG).P$2(B1) R16(PG).1 R18(PG).2 R31(PG).2
N$99: C8(PG).2 P1(PG).1(E) R19(PG).1 U6(PG).1
PE: C1(TA).1 C1(VC).2 C2(PG).2 C4.- C5(PG).2 C6(PG).2 C8.- C13.- C15.P$2 C18.+ C19.2(-) C20.1(+) C21.2 C22.1 C23.2 C24.2 C26.P$2 C27.1 C28.2 C29.+ C30.- D1(PG).A D4.C JP1.1 Q1(PG).1(B) Q6(PG).P$1(B) R1(PG).1 R1(TA).1 R1.1 R2(PG).1 R3(PG).2 R3(TA).1 R4.1 R5.1 R8.1 R13(PG).1 R13.1 R15.1 R16(PG).2 R17.1 R21.1 R24.1 R25(PG).2 R26.1 R28(PG).1 R31.1 R34.1 U1(HA).3(+IN) U1(PG).13(-IN) U1.2(GND) U1.3(GND) U1.6(GND) U1.7(GND) U2.1(GND) U3(PG).8(-VSS) U3(PG).13(CLR) U3.14(+IN) U5(PG).1(A:A) U5(PG).4(C:A) U6(PG).3 U6(PG).5
PITCH: JP4.3 R19(PG).2
TUNER: C1(TA).2 JP2.6 R1(TA).2 U1(TA).5(OUT_2)
VCA: C28.1 D5.C JP3.5 R3(VC).2 R30.1 U3.12(OUT)
VCV: JP4.2 R4(VC).1 R26(PG).1
Unconnected: JP4.4 JP4.5 JP4.6 L4.P$2(Z) L4.P$4(A2) L4.P$6(E2) L4.P$7(S1) L4.P$8(S2) L5.P$2(Z) L5.P$4(A2) L5.P$6(E2) L5.P$7(S1) L5.P$8(S2) L9.P$2(Z) L9.P$4(A2) L9.P$6(E2) L9.P$7(S1) L9.P$8(S2) Q2(PG).P$6(C1) U1(HA).1(ON1) U1(HA).5(ON2) U1(HA).8(OPT) U1(PG).2(DIODE_BIAS_2) U1(PG).7(BUFFER_IN_2) U1(PG).8(BUFFER_OUT_2) U1(PG).9(BUFFER_OUT) U1(PG).10(BUFFER_IN) U1(PG).15(DIODE_BIAS) U1(TA).2(DIODE_BIAS_2) U1(TA).7(BUFFER_IN_2) U1(TA).8(BUFFER_OUT_2) U1(TA).9(BUFFER_OUT) U1(TA).10(BUFFER_IN) U1(TA).12(OUT) U1(TA).13(-IN) U1(TA).14(+IN) U1(TA).15(DIODE_BIAS) U1(TA).16(AMP_BIAS_IN) U1.4(NC) U1.5(NC) U3(PG).4(Q5) U3(PG).5(Q6) U3(PG).10(Q7) U3(PG).11(Q4) U8(PG).11(D:O) U8(PG).12(D:I0) U8(PG).13(D:I1)

### Notes on the sheet
- GATE
- Tuner Amplifier
- Headphone Amplifier
- Input
- Gate Out 0/10V
- Volume CV 0-10V
- From Volume CV Circuit
- Sample and Hold
- Audio Cycle Timing Counter
- Audio Cycle Timing Counter
- Period Voltage
- Front Panel
- <1
- <2
- -12V | <3
- GND | <4
- <5
- <6
- <7
- +12V | <8
- <9
- Volume Antenna Circuit
- Pin 1 Audio out
- Pin 2 Brightness
- Pin 3 Waveform
- Pin 4 Volume | <10
- Variable Pitch Oscillator | Pin 5 Pitch
- Pin 6 Tuner
- Volume Tuning
- Fixed Pitch Oscillator
- Pitch Tuning
- <5
- 1<
- Volume CV Circuit
- Pin 1 Ground
- Pin 2 14 VAC to switch
- Pin 3 Headphone Audio1
- Pin 4 LED power
- Pin 5 Headphone Audio2
- Pin 6 14 VAC from switch
- Power Supply
- <7
- Detector
- <9 | VCA Processor
- <10 | Audio Out | Voltage Controled Amplifier
- 2< | 8<
- 8 | Aux
- 4<
- Audio
- To Gate Circuit
- +12V
- -12V
- Amp Out
- Amp In
- VCA Out
- 1 | Ground
- 3<
- Pin 1 +12V
- Pin 2 -12V | Pin 1 gate
- Pin 3 Amp Out | Pin 2 CV Volume
- Pin 4 Amp In | Pin3 CV Pitch
- Pin 5 VCA Out
- Pin 6 Headphone Volume

## Sheet 2 of 2

## Power pins joined to a net without a drawn wire
VDD: U2(PG).14(P:VDD) U5(PG).14(P:VDD) U8(PG).14(P:VDD)
VSS: U2(PG).7(P:VSS) U5(PG).7(P:VSS) U8(PG).7(P:VSS)

## Library data of the parts
C1 C5 = ZOMGTHEREMINBBQLOL:23PRADIALSTYRENE: Xicon 23P 3300pF Radial Polystyrene capacitor
C1(HA) C1(TA) C1(VC) C2 C2(PG) C3(PG) C4(PG) C5(PG) C6 C6(PG) C7(PG) C8(PG) C9 C9(PG) C10(PG) C12 C16 C21-C24 C27 C28 = resistor:C-US: CAPACITOR, American symbol
C1(PG) = rcl:C-US: CAPACITOR, American symbol
C3 C7 C26 = ZOMGTHEREMINBBQLOL:XYPOLYESTERCAP: XY Polyester .01uF capacitor
C4 C8 C10 C11 C13 C17 C18 C25 C29 C30 = rcl:CPOL-US: POLARIZED CAPACITOR, American symbol
C14 = ZOMGTHEREMINBBQLOL:23PSTYRENE: Xicon 23PS218 1800pF Polystyrene capacitor
C15 = ZOMGTHEREMINBBQLOL:POLYESTERCAP: stupid 6800pF cap
C19 C20 = SparkFun:CAP_POL: Capacitor Polarized These are standard SMD and PTH capacitors. Normally 10uF, 47uF, and 100uF in electrolytic and tantalum varieties. Always verify the external diameter of the through hole cap, it varies with capacity, voltage, and manufacturer. The EIA devices should be standard.
D1 D1(PG) D2(PG) D4 D5 = diode:1N4148: DIODE high speed (Philips)
D2 D3 = ZOMGTHEREMINBBQLOL:FAIL1N4001DIODE: On Semiconductor FAILDIODE SZ2640 YAY NSL
JP1-JP4 = pinhead:PINHD-2X3: PIN HEADER
L1-L3 L6-L8 = ZOMGTHEREMINBBQLOL:6300.CHOKES: Bourns 6300 series choke
L4 L5 = ZOMGTHEREMINBBQLOL:7P: Toko Type 7P Variable Inductors
L9 = ZOMGTHEREMINBBQLOL:10K: Toko Type 10K variable inductors
P1(PG) P2(PG) = ZOMGTHEREMINBBQLOL:3299Y: Bournes 3299Y resistor trimmer
PITCH.ANTENNA VOLUME.ANTENNA = discrete:ANTENNA: Antenna
Q1 Q2 Q2(PG) Q3 Q6(PG) = ZOMGTHEREMINBBQLOL:DMMT3904W: Dual Matched NPN
Q1(PG) = ZOMGTHEREMINBBQLOL:MMBT3906: Fairchild Semiconductor MMBT3906
Q4 Q5 = ZOMGTHEREMINBBQLOL:MMBT3904: Fairchild MMBT3904 NPN transistor
R1 R1(PG) R1(VC) R2 R2(PG) R2(VC) R3 R3(PG) R3(VC) R4 R4(PG) R4(VC) R5 R5(PG) R6 R6(PG) R7 R7(PG) R8 R8(PG) R9 R9(PG) R10 R10(PG) R11 R11(PG) R12 R12(PG) R13 R13(PG) R15 R15(PG) R16 R17 R17(PG) R18 R18(PG) R19 R19(PG) R20 R20(PG) R21 R21(PG) R22-R24 R24(PG) R25 R25(PG) R26 R26(PG) R27 R28 R28(PG) R29-R31 R31(PG) R32-R34 R38-R41 = resistor:R-US_: RESISTOR, American symbol
R1(HA) R1(TA) R2(HA) R2(TA) R3(HA) R3(TA) R4(HA) R4(TA) R14 R14(PG) R22(PG) R23(PG) R27(PG) R29(PG) R30(PG) R35-R37 = SparkFun:RESISTOR: Resistor Basic schematic elements and footprints for 0603, 1206, and PTH 1/10th watt (small) resistors.
R16(PG) = ZOMGTHEREMINBBQLOL:LT1/4LT52R102J3900: KOA Speer Electronics LT1/4LT52R102J3900 PTO Thermistor
U1 = linear:78L*SMD: Positive VOLTAGE REGULATOR
U1(HA) = linear:TL081: OP AMP
U1(PG) U1(TA) U3 = ZOMGTHEREMINBBQLOL:LM13700M
U2 = ZOMGTHEREMINBBQLOL:L7912CD2T: ST L7912CD2T negative voltage regulator
U2(PG) U8(PG) = 40xx:4093: Quad 2-input NAND schmitt trigger
U3(PG) = ZOMGTHEREMINBBQLOL:CD4022BPWR: TI CD4022BPWR Counter Shift Register Octal Divider
U4(PG) U6(PG) = ZOMGTHEREMINBBQLOL:TL062: TL062 Dual Op Amp
U5(PG) = 40xx:4016: Quad bilateral ANALOG SWITCH

## Board
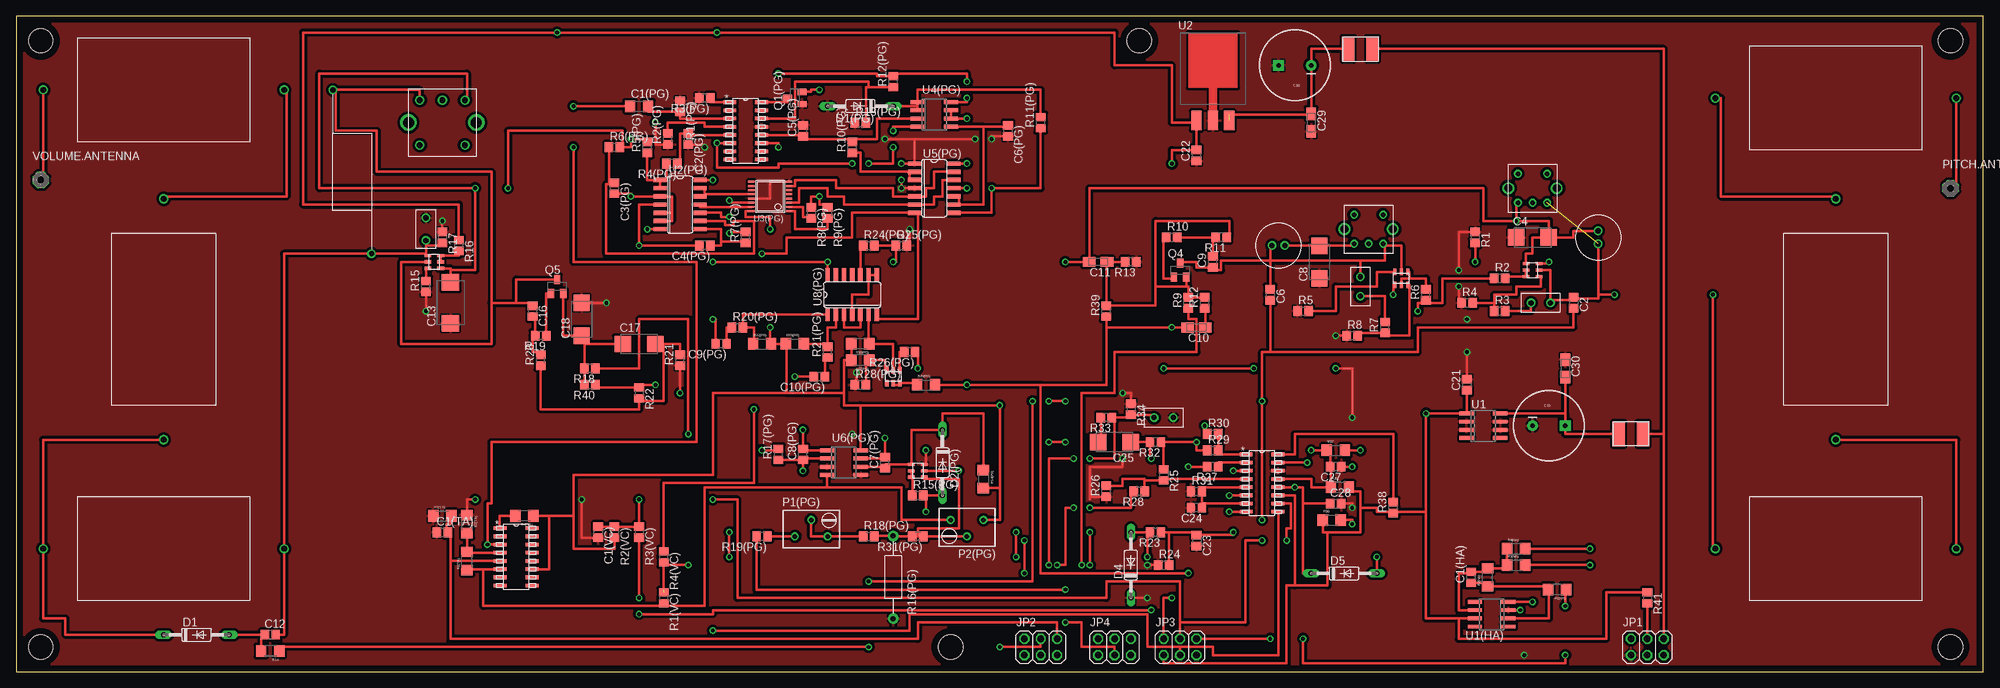
[diagram p7: board, top side]
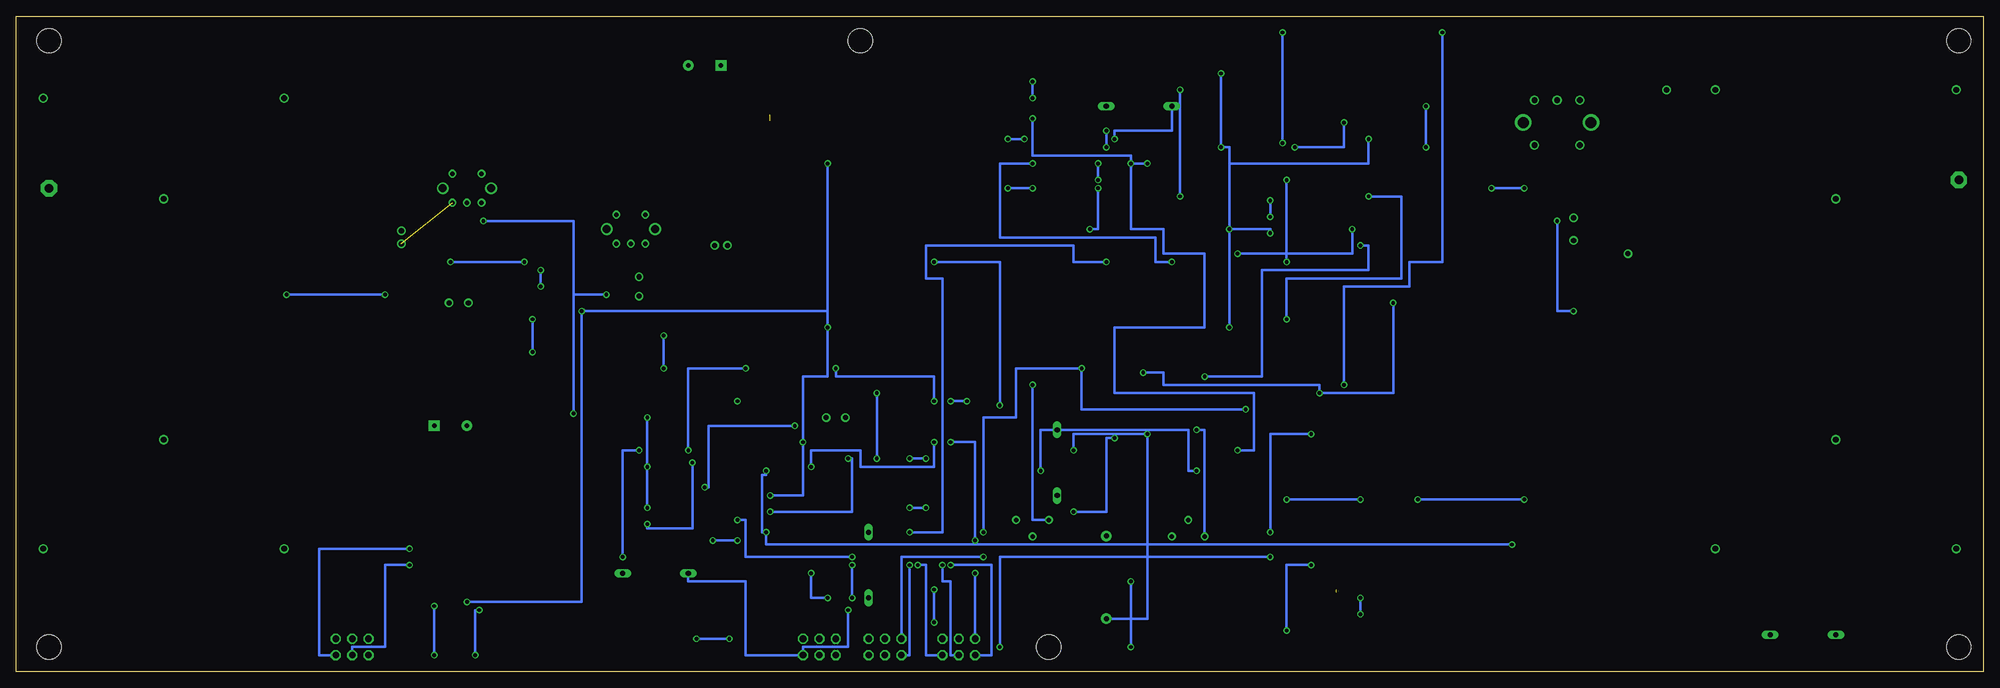
[diagram p8: board, bottom side, seen from below]

Size 304.8 x 101.6 mm. Coordinates in mm from the lower left corner, seen from the top.
Outline: 0,0 304.8,0 304.8,101.6 0,101.6 0,0
Copper layers (1*16): Top 0.035mm / dielectric 1.5mm / Bottom 0.035mm
Design rules "default": minimum track width 10mil, minimum drill 24mil, track to track 8mil, track to pad 8mil, pad to pad 8mil, via to via 8mil, smd to smd 8mil, copper to edge 40mil, drill to drill 8mil, minimum pad ring 10mil, minimum via ring 8mil, stop-mask expansion 4mil, vias tented up to drill 0mil, thermal gap 10mil
Holes 3.81 mm at 3.81,97.79 3.81,3.81 299.72,97.79 299.72,3.81 173.99,97.79 144.78,3.81

### Footprints (pad centres in the part's own frame; a part is rotated, then mirrored left to right if it is on the bottom)
23PRADIALSTYRENE = drill 0.8 round: P$1 -1,0; P$2 1,0
C0805 = smd 1.3 x 1.5: 1 -0.85,0; 2 0.85,0
C1206 = smd 1.6 x 1.8: 1 -1.4,0; 2 1.4,0
XYPOLYESTERCAP = drill 0.8 round: P$1 -1.5,0; P$2 1.5,0
C/6032-28R = smd 2.55 x 2.5: + 2.525,0; - -2.525,0
A/3216-18R = smd 1.95 x 1.5: + 1.375,0; - -1.375,0
D/7343-31R = smd 2.55 x 2.7: + 3.175,0; - -3.175,0
23PSTYRENE = drill 0.8 round: P$1 -12.7,-3; P$2 12.7,3
POLYESTERCAP = drill 0.8 round: P$1 -1.75,0; P$2 1.75,0
CPOL-RADIAL-1000UF-25V = drill 0.7 pad 1.651 square: 1 2.54,0 | drill 0.7 pad 1.651 round: 2 -2.54,0
DO35-10 = drill 0.813 long: A 5.08,0; C -5.08,0
FAIL1N4001DIODE = smd 1.93 x 3.81: A -1.875,0; C 1.875,0
2X03 = drill 1.016 octagon: 1 -2.54,-1.27; 2 -2.54,1.27; 3 0,-1.27; 4 0,1.27; 5 2.54,-1.27; 6 2.54,1.27
6300.CHOKES = drill 0.9 round: 1 -18.669,0; 2 18.669,0
7P = drill 0.7 round: P$1 2.25,2.25; P$2 0,2.25; P$3 -2.25,2.25; P$4 -2.25,-2.25; P$6 2.25,-2.25 | drill 1.2 round: P$7 -3.75,0; P$8 3.75,0
10K = drill 0.9 round: P$1 3.5,3.5; P$2 0,3.5; P$3 -3.5,3.5; P$4 -3.5,-3.5; P$6 3.5,-3.5 | drill 1.7 round: P$7 -5.25,0; P$8 5.25,0
3299Y = drill 0.7 round: 1 1.27,-2.54; 2 -1.27,0; 3 1.27,2.54
PAD-01 = drill 1.321 pad 2.54 octagon: 1 0,0
SOT363 = smd 0.508 x 1.016: P$1 -1,1; P$2 1,1; P$3 0,1; P$4 0,-1; P$5 1,-1; P$6 -1,-1
SOT23 = smd 1 x 1.4: 1 -0.95,-1.1; 2 0.95,-1.1; 3 0,1.1
R0805 = smd 1.3 x 1.5: 1 -0.85,0; 2 0.85,0
1206 = smd 1.6 x 1.8: 1 -1.4,0; 2 1.4,0
LT1/4LT52R102J3900 = drill 0.8 pad 1.6 round: 1 -6.413,0; 2 6.413,0
SO08 = smd 0.6 x 2.2: 1 -1.905,-2.6; 2 -0.635,-2.6; 3 0.635,-2.6; 4 1.905,-2.6; 5 1.905,2.6; 6 0.635,2.6; 7 -0.635,2.6; 8 -1.905,2.6
M16A = smd 1.981 x 0.559: 1 -2.464,4.445; 2 -2.464,3.175; 3 -2.464,1.905; 4 -2.464,0.635; 5 -2.464,-0.635; 6 -2.464,-1.905; 7 -2.464,-3.175; 8 -2.464,-4.445; 9 2.464,-4.445; 10 2.464,-3.175; 11 2.464,-1.905; 12 2.464,-0.635; 13 2.464,0.635; 14 2.464,1.905; 15 2.464,3.175; 16 2.464,4.445
DDPAK = smd 1.6 x 2.997: 1 0,-8.572; 2 2.54,-8.572; 3 -2.54,-8.572
SO14 = smd 0.66 x 2.032: 1 -3.81,-3.073; 2 -2.54,-3.073; 3 -1.27,-3.073; 4 0,-3.073; 5 1.27,-3.073; 6 2.54,-3.073; 7 3.81,-3.073; 8 3.81,3.073; 9 2.54,3.073; 10 1.27,3.073; 11 0,3.073; 12 -1.27,3.073; 13 -2.54,3.073; 14 -3.81,3.073
TSSOP16 = smd 0.305 x 0.991: 1 -2.275,-2.918; 2 -1.625,-2.918; 3 -0.975,-2.918; 4 -0.325,-2.918; 5 0.325,-2.918; 6 0.975,-2.918; 7 1.625,-2.918; 8 2.275,-2.918; 9 2.275,2.918; 10 1.625,2.918; 11 0.975,2.918; 12 0.325,2.918; 13 -0.325,2.918; 14 -0.975,2.918; 15 -1.625,2.918; 16 -2.275,2.918
SO8 = smd 0.6 x 2.2: 1 -1.905,-2.6; 2 -0.635,-2.6; 3 0.635,-2.6; 4 1.905,-2.6; 5 1.905,2.6; 6 0.635,2.6; 7 -0.635,2.6; 8 -1.905,2.6

### Placement (x,y rotation side)
C1  245.11,67.31 270 top
C1(HA)  225.43,14.6 90 top
C1(PG)  96.52,87.63 0 top
C1(TA)  66.04,21.59 0 top
C1(VC)  90.17,21.59 270 top
C2  241.3,57.15 270 top
C2(PG)  104.14,82.55 270 top
C3  236.22,57.15 180 top
C3(PG)  92.71,74.93 270 top
C4  234.95,67.31 0 top
C4(PG)  106.68,66.04 180 top
C5  195.58,66.04 180 top
C5(PG)  121.92,83.82 90 top
C6  194.31,58.42 270 top
C6(PG)  153.67,83.82 270 top
C7  208.28,59.69 270 top
C7(PG)  134.62,32.38 90 top
C8  201.93,63.5 90 top
C8(PG)  121.92,33.66 90 top
C9  185.42,63.5 90 top
C9(PG)  109.22,50.8 180 top
C10  182.88,53.34 180 top
C10(PG)  124.46,45.72 180 top
C11  167.64,63.5 180 top
C12  39.37,5.71 0 top
C13  67.31,57.15 90 top
C14  52.07,77.47 270 top
C15  63.5,68.58 90 top
C16  80.01,55.88 270 top
C17  96.52,50.8 0 top
C18  87.63,54.61 90 top
C19  237.49,38.1 0 top
C20  198.12,93.98 180 top
C21  224.79,44.45 90 top
C22  182.88,80.01 90 top
C23  182.88,20.32 270 top
C24  182.88,25.4 180 top
C25  170.18,35.56 180 top
C26  177.8,39.37 0 top
C27  204.47,31.75 180 top
C28  204.47,26.03 0 top
C29  200.66,85.09 270 top
C30  240.03,46.99 270 top
D1  27.94,5.71 0 top
D1(PG)  130.81,87.63 180 top
D2  250.19,36.83 180 top
D2(PG)  143.51,32.38 270 top
D3  208.28,96.52 0 top
D4  172.72,16.51 90 top
D5  205.74,15.24 0 top
JP1  252.73,3.81 0 top
JP2  158.75,3.81 0 top
JP3  180.34,3.81 0 top
JP4  170.18,3.81 0 top
L1  281.94,88.9 0 top
L2  281.94,54.61 90 top
L3  281.94,19.05 180 top
L4  209.55,68.58 180 top
L5  234.95,74.93 180 top
L6  22.86,90.17 0 top
L7  22.86,54.61 90 top
L8  22.86,19.05 180 top
L9  66.04,85.09 0 top
P1(PG)  123.19,22.22 270 top
P2(PG)  147.32,22.22 90 top
PITCH.ANTENNA  299.72,74.93 0 top
Q1  234.95,62.23 270 top
Q1(PG)  120.65,88.9 90 top
Q2  214.63,60.96 0 top
Q2(PG)  135.89,45.72 0 top
Q3  64.77,63.5 90 top
Q4  180.34,62.23 0 top
Q5  83.82,59.69 0 top
Q6(PG)  139.7,31.11 270 top
R1  226.06,67.31 270 top
R1(HA)  238.76,12.7 180 top
R1(PG)  102.87,87.63 270 top
R1(TA)  66.04,24.13 0 top
R1(VC)  100.33,11.43 270 top
R2  229.87,60.96 0 top
R2(HA)  227.97,14.6 90 top
R2(PG)  100.97,82.55 90 top
R2(TA)  69.85,17.14 90 top
R2(VC)  92.71,21.59 270 top
R3  229.87,55.88 0 top
R3(HA)  232.41,16.51 0 top
R3(PG)  106.68,88.9 180 top
R3(TA)  69.85,22.86 270 top
R3(VC)  96.52,21.59 270 top
R4  224.79,57.15 0 top
R4(HA)  232.41,19.05 0 top
R4(PG)  101.6,78.74 180 top
R4(TA)  78.74,24.13 180 top
R4(VC)  100.33,17.78 270 top
R5  199.39,55.88 0 top
R5(PG)  97.79,81.28 90 top
R6  218.44,58.42 90 top
R6(PG)  92.71,81.28 0 top
R7  212.09,53.34 90 top
R7(PG)  113.03,67.31 90 top
R8  207.01,52.07 0 top
R8(PG)  123.19,71.12 270 top
R9  181.61,57.15 90 top
R9(PG)  125.73,71.12 270 top
R10  179.07,67.31 0 top
R10(PG)  129.54,81.28 90 top
R11  186.69,67.31 180 top
R11(PG)  158.75,85.09 90 top
R12  184.15,57.15 90 top
R12(PG)  135.89,91.44 90 top
R13  172.72,63.5 180 top
R13(PG)  130.81,85.09 0 top
R14  39.37,3.17 180 top
R14(PG)  149.86,29.84 270 top
R15  63.5,59.69 90 top
R15(PG)  139.7,27.3 0 top
R16  68.58,66.04 270 top
R16(PG)  135.89,14.6 270 top
R17  66.04,67.31 270 top
R17(PG)  118.11,33.66 90 top
R18  88.9,46.99 180 top
R18(PG)  132.08,20.95 0 top
R19  81.28,52.07 180 top
R19(PG)  115.57,20.95 180 top
R20  81.28,48.26 90 top
R20(PG)  111.76,53.34 0 top
R21  102.87,48.26 90 top
R21(PG)  125.73,49.53 90 top
R22  96.52,43.18 270 top
R22(PG)  115.57,50.8 0 top
R23  176.53,21.59 180 top
R23(PG)  120.65,50.8 0 top
R24  177.8,16.51 0 top
R24(PG)  132.08,66.04 0 top
R25  177.8,30.48 270 top
R25(PG)  137.16,66.04 0 top
R26  168.91,27.94 90 top
R26(PG)  138.43,49.53 180 top
R27  185.42,31.75 180 top
R27(PG)  130.81,48.26 180 top
R28  173.99,27.94 180 top
R28(PG)  130.81,44.45 0 top
R29  185.42,34.29 0 top
R29(PG)  140.97,44.45 0 top
R30  185.42,36.83 0 top
R30(PG)  130.81,50.8 180 top
R31  182.88,27.94 0 top
R31(PG)  139.7,20.95 180 top
R32  176.53,35.56 180 top
R33  168.91,39.37 180 top
R34  172.72,40.64 270 top
R35  205.11,28.57 0 top
R36  203.84,23.49 0 top
R37  204.47,34.29 0 top
R38  213.36,25.4 90 top
R39  168.91,55.88 90 top
R40  88.9,44.45 180 top
R41  252.73,11.43 270 top
U1  227.33,38.1 270 top
U1(HA)  228.6,8.89 90 top
U1(PG)  113.03,83.82 0 top
U1(TA)  77.47,17.78 0 top
U2  185.42,93.98 0 top
U2(PG)  102.87,72.39 270 top
U3  193.04,29.21 0 top
U3(PG)  116.84,73.66 90 top
U4(PG)  142.24,86.36 270 top
U5(PG)  142.24,74.93 270 top
U6(PG)  128.27,32.38 270 top
U8(PG)  129.54,58.42 0 top
VOLUME.ANTENNA  3.81,76.2 0 top

### Tracks (layer width: path | path; a pad name or v marks a point on that pad's centre or on a via)
3  (via drill 0.6)
  Top 0.406: C1(VC).1 R2(VC).1 R3(VC).1 v96.52,26.67 | U3.10 197.49,26.03 197.49,22.22 196.85,22.22 v196.85,20.32 | v193.04,20.32 190.5,20.32 190.5,7.62 180.34,7.62 | 180.34,7.62 JP3.4 | v107.95,26.67 111.76,26.67 111.76,11.43 168.91,11.43 168.91,13.97 180.34,13.97 180.34,7.62
  Bottom 0.406: v193.04,20.32 v196.85,20.32 | v107.95,26.67 v96.52,26.67
4  (via drill 0.6)  (1 unrouted)
  Top 0.406: 100.33,16.51 100.33,12.7 | 100.33,16.51 R4(VC).2 | v104.14,16.51 100.33,16.51 | 180.34,3.81 185.42,3.81 185.42,2.54 195.58,2.54 195.58,24.76 U3.9 | 180.34,3.81 JP3.3 | 180.34,3.81 175.26,3.81 175.26,8.89 138.43,8.89 138.43,6.35 v107.95,6.35
  Bottom 0.406: v104.14,16.51 107.95,16.51 v107.95,6.35
7  (via drill 0.6)
  Top 0.406: R24.2 178.65,21.59 R23.1 182.88,21.59 C23.1 188.59,21.17 v188.59,21.59 | v188.59,31.11 U3.3 | U1(TA).3 v73.03,19.68 73.03,26.03 73.66,26.03 73.66,35.56 105.41,35.56 105.41,63.5 86.36,63.5 v86.36,81.28 | v86.36,87.63 C1(PG).1
  Bottom 0.406: v188.59,31.11 188.59,30.48 189.23,30.48 189.23,21.59 v188.59,21.59 188.59,19.68 v73.03,19.68 | v86.36,81.28 v86.36,87.63
+12V  (via drill 0.6)
  Top 0.406: C21.1 224.79,40 U1.1 v218.44,40 218.44,24.76 | Q3.P$6 67.31,62.5 67.31,62.23 | 67.31,62.23 C13.+ | 67.31,62.23 71.12,62.23 v71.12,74.93 46.99,74.93 46.99,92.71 69.85,92.71 69.85,88.59 L9.P$1 | R2(VC).2 92.71,19.05 86.36,19.05 86.36,24.13 | 82.55,24.13 R4(TA).1 | 82.55,24.13 82.55,15.88 U1(TA).11 | 223.52,8.25 U1(HA).7 | 223.52,8.25 223.52,5.08 246.38,5.08 246.38,12.28 R41.1 | 213.36,24.76 R38.1 | 213.36,24.76 210.82,24.76 210.82,25.4 208.28,25.4 | 208.28,25.4 208.28,27.94 206.5,27.94 R35.2 | 208.28,25.4 208.28,21.59 203.2,21.59 | 203.2,21.59 202.44,21.59 R36.1 | U3.11 198.12,27.3 198.12,13.33 | 198.12,13.33 203.2,13.33 203.2,21.59 | C1.P$1 241.3,68.31 241.3,67.31 C4.+ | L5.P$1 232.41,72.68 v232.41,69.85 | v232.41,69.85 237.48,69.85 | 237.48,69.85 237.49,69.85 | 237.48,69.85 C4.+ | C4.+ 234.95,67.31 234.95,64.77 233.95,64.77 Q1.P$6 | U4(PG).8 147.32,88.27 v147.32,88.9 | v147.32,91.44 147.32,92.71 135.89,92.71 R12(PG).2 133.35,92.29 133.35,92.71 v118.11,92.71 | R5(PG).2 97.79,82.55 v95.25,82.55 95.25,81.28 R6(PG).2 93.98,81.28 93.98,83.82 76.2,83.82 v76.2,74.93 | 152.4,28.44 R14(PG).2 | U6(PG).8 130.81,34.29 130.81,41.27 | 130.81,41.27 v152.4,41.27 152.4,28.44 | P2(PG).1 152.4,23.49 152.4,28.44 | R27(PG).2 129.54,48.26 | R27(PG).2 R30(PG).2 | 119.38,43.18 119.38,50.8 R23(PG).1 R22(PG).2 116.84,50.8 v116.84,53.34 | 119.38,43.18 128.27,43.18 | 128.27,43.18 128.27,48.26 R27(PG).2 | Q2.P$6 213.36,59.96 v213.36,58.42 | v162.56,63.5 C11.+ 166.27,74.93 227.33,74.93 227.33,69.85 v232.41,69.85 | 128.27,43.18 128.27,41.27 130.81,41.27 | 218.44,24.76 213.36,24.76 | 223.52,8.25 218.44,8.25 218.44,24.76
  Top 0.406: U3(PG).16 113.03,71.38 113.03,70.48 116.84,70.48 v116.84,68.58 | R7(PG).2 110.49,68.16 v110.49,67.94 | U1(PG).11 118.11,81.91 v118.11,81.28 | 198.12,13.33 196.85,13.33 196.85,1.27 177.8,1.27 JP3.1 | 86.36,24.13 82.55,24.13 | 119.38,43.18 107.95,43.18 107.95,30.48 86.36,30.48 86.36,24.13
  Bottom 0.406: v147.32,91.44 v147.32,88.9 | 218.44,58.42 v213.36,58.42 | 218.44,58.42 v218.44,40 | 218.44,58.42 218.44,69.85 v232.41,69.85 | v152.4,41.27 152.4,63.5 v162.56,63.5 | v116.84,68.58 110.49,68.58 v110.49,67.94 | 116.84,78.74 v116.84,68.58 | v116.84,68.58 v116.84,53.34 | v118.11,92.71 v118.11,81.28 116.84,81.28 116.84,78.74 | 116.84,78.74 95.25,78.74 v95.25,82.55 | v76.2,74.93 v71.12,74.93
-12V  (via drill 0.6)
  Top 0.406: 182.88,86.36 U2.3 182.88,85.09 | 182.88,85.09 C22.2 179.07,80.86 v179.07,78.74 | R16.1 68.58,72.39 44.45,72.39 44.45,99.06 v83.82,99.06 v108.59,99.06 170.18,99.06 170.18,93.98 179.07,93.98 179.07,85.09 182.88,85.09 | 89.75,44.87 R40.1 89.75,44.03 R22.1 96.52,44.45 v99.06,44.45 | 72.39,15.88 69.98,15.88 R2(TA).1 | 72.39,15.88 U1(TA).6 | 72.39,15.88 72.39,10.16 99.91,10.16 R1(VC).2 100.33,10.16 106.68,10.16 106.68,28.57 125.67,28.57 | R29.1 182.88,34.29 v182.88,35.56 R32.1 177.8,35.56 R25.1 | v187.96,27.3 U3.6 | 168.91,53.34 v179.07,53.34 C10.+ | 168.91,53.34 R39.1 | U4(PG).4 135.89,84.45 v135.89,83.82 | v135.89,81.28 135.89,78.74 v132.08,78.74 | v129.54,78.74 118.11,78.74 118.11,78.1 108.59,78.1 v108.59,81.91 U1(PG).6 | P2(PG).3 137.16,23.49 137.16,28.57 125.67,28.57 | 125.67,28.57 U6(PG).4 | 218.44,57.78 R6.1 218.44,57.15 | R2.1 220.98,60.96 220.98,57.15 218.44,57.15 | 218.44,57.15 217.17,57.15 v217.17,55.88 | v234.95,10.79 U1(HA).4 | 168.91,53.34 168.91,44.45 158.75,44.45 | 158.75,44.45 v147.32,44.45 R29(PG).2 | 158.75,44.45 158.75,15.24 v181.61,15.24 | v179.07,11.43 177.8,11.43 JP3.2
  Bottom 0.406: v187.96,27.3 182.88,27.3 v182.88,35.56 182.88,45.72 179.07,45.72 v179.07,53.34 179.07,55.88 | v135.89,81.28 v135.89,83.82 | v129.54,78.74 v132.08,78.74 | v108.59,99.06 v108.59,81.91 | v83.82,99.06 83.82,63.5 88.9,63.5 88.9,59.69 99.06,59.69 v99.06,44.45 | 179.07,55.88 v179.07,78.74 | 179.07,55.88 v217.17,55.88 217.17,10.79 v234.95,10.79 | v147.32,44.45 147.32,23.49 P2(PG).3 | v181.61,15.24 181.61,11.43 v179.07,11.43
<2
  Top 0.406: JP1.6 255.27,36.83 | 255.27,36.83 255.27,96.52 D3.C | 255.27,36.83 D2.A
<5  (via drill 0.6)
  Top 0.406: R9.1 181.61,54.61 182.88,54.61 182.88,49.53 170.18,49.53 170.18,43.18 165.1,43.18 v165.1,16.51
  Bottom 0.406: v165.1,16.51 163.83,16.51 163.83,2.54 JP2.5
<6  (via drill 0.6)
  Top 0.406: R18.1 96.52,46.99 96.52,54.61 104.14,54.61 v104.14,36.83 | v110.49,17.78 v110.49,21.59 | v152.4,3.81 158.75,3.81 JP2.4
  Bottom 0.406: v104.14,36.83 110.49,36.83 v110.49,21.59 | v110.49,17.78 152.4,17.78 v152.4,3.81
<7  (via drill 0.6)
  Top 0.406: v161.29,16.51 162.56,16.51 162.56,25.4 v163.83,25.4 | R28.2 172.72,27.94 172.72,25.4 v166.37,25.4
  Bottom 0.406: JP2.3 160.02,2.54 160.02,13.97 161.29,13.97 v161.29,16.51 | v166.37,25.4 v163.83,25.4
<9  (via drill 0.6)
  Top 0.406: v181.61,31.75 R27.2 | v162.56,35.56 v160.02,35.56 | v156.21,20.32 v156.21,15.24
  Bottom 0.406: v181.61,31.75 181.61,34.29 173.99,34.29 173.99,31.75 162.56,31.75 v162.56,35.56 | v160.02,35.56 156.21,35.56 v156.21,20.32 | v156.21,15.24 JP2.2
<10  (via drill 0.6)
  Top 0.406: C26.P$1 176.3,39.79 R34.2 172.72,39.37 R33.1 170.18,39.37 170.18,33.02 v166.37,33.02 | v160.02,16.51 160.02,33.02 v163.83,33.02
  Bottom 0.406: v160.02,16.51 153.67,16.51 153.67,2.54 JP2.1 | v166.37,33.02 v163.83,33.02
D1(PG)
  Top 0.406: 139.64,87.63 U4(PG).1 139.64,90.17 158.75,90.17 R11(PG).2 | 139.64,87.63 U4(PG).2 | D1(PG).C 139.64,87.63
G1  (via drill 0.6)
  Top 0.406: 101.6,71.12 101.6,73.66 U2(PG).3 v95.25,73.66 95.25,74.08 C3(PG).2 | U2(PG).6 101.6,69.85 101.6,71.12 | 101.6,71.12 U2(PG).5 | v107.95,54.61 108.37,54.61 C9(PG).2
  Bottom 0.406: v95.25,73.66 90.17,73.66 90.17,60.96 107.95,60.96 v107.95,54.61
G2  (via drill 0.6)
  Top 0.406: C4(PG).2 v96.52,66.04 96.52,72.39 U2(PG).4 | v120.65,45.72 C10(PG).2
  Bottom 0.406: v120.65,45.72 111.76,45.72 111.76,62.23 95.25,62.23 95.25,66.04 v96.52,66.04
GATE  (via drill 0.6)
  Top 0.406: R24(PG).2 R25(PG).1 136.31,63.5 v135.89,63.5 | v166.37,21.59 v166.37,16.51
  Bottom 0.406: JP4.1 166.37,2.54 v166.37,16.51 | v166.37,21.59 161.29,21.59 161.29,60.96 163.83,60.96 163.83,66.04 140.97,66.04 140.97,63.5 v135.89,63.5
HEADPHONE1  (via drill 0.6)
  Top 0.406: R3(HA).2 v243.84,16.51
  Bottom 0.406: v243.84,16.51 247.65,16.51 247.65,3.81 252.73,3.81 JP1.3
HEADPHONE2  (via drill 0.6)
  Top 0.406: R4(HA).2 v243.84,19.05
  Bottom 0.406: v243.84,19.05 257.81,19.05 257.81,2.54 JP1.5
HEADPHONEVOL  (via drill 0.6)
  Top 0.406: R1(HA).1 240.03,12.7 v240.03,10.16 | v240.03,2.54 240.03,1.27 199.39,1.27 v199.39,5.08 | v194.31,5.08 JP3.6
  Bottom 0.406: v240.03,2.54 v240.03,10.16 | v199.39,5.08 v194.31,5.08
N$1  (via drill 0.6)
  Top 0.406: D4.A R23.2 175.26,21.59 v175.26,17.78 | C2.2 241.3,53.34 217.17,53.34 217.17,49.53 194.31,49.53 | 194.31,49.53 C6.2 | v193.04,23.49 193.04,49.53 194.31,49.53
  Bottom 0.406: v193.04,23.49 191.77,23.49 191.77,17.78 v175.26,17.78
N$2
  Top 0.406: U3.4 177.8,29.84 R25.2 174.84,29.63 | 174.84,29.63 R28.1 | R26.2 171.45,28.79 171.45,29.84 174.84,29.84 174.84,29.63
N$3
  Top 0.406: D2.C 240.03,36.83 C19.1 | C19.1 C30.+ | C19.1 240.03,40 U1.8
N$4  (1 unrouted)
  Top 0.406: D3.A 200.66,96.52 C20.2 C29.- 200.66,86.36 187.96,86.36
N$5  (via drill 0.6)
  Top 0.406: U3(PG).14 110.49,72.69 v110.49,73.03 | v110.49,70.48 109.22,70.48 109.22,71.12 U2(PG).10
  Bottom 0.406: v110.49,73.03 v110.49,70.48
N$6
  Top 0.406: U3.7 183.73,26.03 C24.1 R31.2 183.73,28.57 U3.5
N$7  (via drill 0.6)
  other vias: 99.06,44.45
N$8
  Top 0.406: C25.+ 168.06,35.56 R33.2
N$9
  Top 0.406: U3.1 186.27,33.66 R29.2 R30.2
N$10  (via drill 0.6)
  Top 0.406: v208.28,34.29 R37.2 | D5.A v210.82,17.78
  Bottom 0.406: v208.28,34.29 210.82,34.29 v210.82,17.78
N$11
  Top 0.406: U8(PG).1 112.61,55.35 R20(PG).2 114.3,53.34 114.3,50.8 R22(PG).1
N$12
  Top 0.406: JP1.4 R41.2
N$13  (via drill 0.6)
  Top 0.406: C25.- R32.2 175.68,33.02 v175.9,33.02 | v187.96,24.76 U3.8
  Bottom 0.406: v187.96,24.76 175.26,24.76 175.26,33.02 v175.9,33.02
N$14  (via drill 0.6)
  other vias: 208.28,34.29
N$15
  Top 0.406: U1(TA).1 74.93,22.22 74.93,24.13 R4(TA).2
N$16  (via drill 0.6)  (1 unrouted)
  Top 0.406: 245.11,58.42 245.11,57.78 241.3,57.78 C2.1 241.3,57.57 237.72,57.57 | 245.11,58.42 C1.P$2 | Q1.P$3 237.72,62.23 237.72,57.57 | 237.72,57.57 C3.P$1 | L3.2 262.89,19.05 v262.89,58.42 | v247.65,58.42 245.11,58.42
  Bottom 0.406: v262.89,58.42 v247.65,58.42
N$17  (via drill 0.6)
  Top 0.406: R14.1 40.77,3.81 v132.08,3.81 | U3.13 200.66,29.84 200.66,28.57 R35.1 203.71,31.75 C27.2 203.62,34.29 R37.1 v200.66,34.29 | v132.08,13.97 157.48,13.97 v157.48,41.91 | v160.02,41.91 v162.56,41.91 | v177.8,46.99 v191.77,46.99
  Bottom 0.406: v132.08,13.97 v132.08,3.81 | v160.02,41.91 v157.48,41.91 | v162.56,41.91 162.56,45.72 177.8,45.72 v177.8,46.99 | v191.77,46.99 200.66,46.99 v200.66,34.29
N$18  (via drill 0.6)
  Top 0.406: R36.2 207.01,23.49 v207.01,22.86 | v200.03,32.38 U3.15
  Bottom 0.406: v200.03,32.38 200.03,22.22 207.01,22.22 v207.01,22.86
N$19
  Top 0.406: L1.1 264.16,88.9 264.16,73.66 281.94,73.66 L2.2
N$20
  Top 0.406: R38.2 213.36,36.83 198.12,36.83 198.12,33.66 U3.16
N$21
  Top 0.406: L2.1 300.61,35.94 L3.1
N$22
  Top 0.406: PITCH.ANTENNA.1 300.61,74.93 L1.2
N$23
  Top 0.406: VOLUME.ANTENNA.1 4.19,76.2 L6.1
N$24
  Top 0.406: L6.2 41.91,90.17 41.91,73.66 22.86,73.66 L7.2
N$25
  Top 0.406: L7.1 4.19,35.94 L8.2 4.19,8.25 7.62,8.25 7.62,5.71 D1.C
N$26
  Top 0.406: Q1.P$2 236.22,61.23 236.22,59.69 232.41,59.69 232.41,58.42 229.02,58.42 229.02,57.15 | 229.02,57.15 R3.1 | R4.2 229.02,57.15
N$27
  Top 0.406: D1.A C12.1 37.97,5.08 R14.2
N$28
  Top 0.406: C16.2 80.43,55.03 R19.2 80.01,52.07 80.01,49.53 81.28,49.53 R20.2
N$29
  Top 0.406: R3.2 234.72,55.88 C3.P$2
N$30
  Top 0.406: Q2.P$3 214.63,66.04 211.8,66.04 L4.P$3 212.09,66.33 212.09,63.73 208.28,63.73 | 208.28,63.73 C7.P$1 | C5.P$2 194.31,66.04 194.31,63.73 | 194.31,63.73 208.28,63.73 | 194.31,63.73 C6.1 | 194.31,63.73 186.69,63.73 186.69,62.23 185.42,62.23 C9.1 182.88,62.65 182.88,63.5 180.34,63.5 Q4.3
N$31  (via drill 0.6)
  Top 0.406: Q1.P$1 237.49,63.23 v237.49,63.5 | v226.06,63.5 R1.2
  Bottom 0.406: v226.06,63.5 v237.49,63.5
N$32
  Top 0.406: Q2.P$1 210.82,61.96 210.82,59.69 204.47,59.69 204.47,55.88 R5.2
N$33
  Top 0.406: Q1.P$4 Q1.P$5 230.72,61.23 R2.2
N$34
  Top 0.406: C5.P$1 201.93,66.04 C8.+ 207.3,66.02 L4.P$1
N$35
  Top 0.406: C7.P$2 212.09,58.19 R7.2
N$36
  Top 0.406: Q2.P$2 215.9,61.96 215.9,60.96 | 215.9,60.96 214.63,60.96 Q2.P$4 | R6.2 218.44,60.96 215.9,60.96
N$37
  Top 0.406: R12.1 184.15,55.88 184.25,55.88 C10.-
N$38
  Top 0.406: R8.2 207.86,52.49 R7.1 212.09,52.07 215.9,52.07 215.9,59.96 Q2.P$5
N$39
  Top 0.406: R10.1 177.8,67.31 177.8,60.96 179.39,60.96 Q4.1
N$40
  Top 0.406: U3.2 186.27,32.38 R27.1
N$41
  Top 0.406: R10.2 R11.2 185.42,67.31 C9.2
N$42
  Top 0.406: R11.1 187.96,67.31 187.96,69.85 176.53,69.85 176.53,59.69 | 181.29,60.96 Q4.2 181.29,59.69 | 176.53,59.69 181.29,59.69 | 181.29,59.69 181.61,59.69 R9.2 R12.2 | 176.53,59.69 176.53,56.73 R39.2 168.91,63.5 C11.- R13.2
N$43
  Top 0.406: Q3.P$5 Q3.P$4 | Q3.P$5 66.04,64.5 | R16.2 68.58,64.5 Q3.P$5
N$44
  Top 0.406: 63.5,66.04 63.5,64.77 | 63.5,66.04 C15.P$1 | Q3.P$2 63.5,64.5 63.5,64.77 | R17.2 66.04,66.04 63.5,66.04 | C12.2 41.53,5.71 L8.1 41.53,64.77 C14.P$2 63.5,64.77
N$45
  Top 0.406: R15.2 63.5,62.5 Q3.P$1
N$46
  Top 0.406: Q3.P$3 59.69,63.5 59.69,50.8 73.66,50.8 73.66,57.15 | 73.66,57.15 73.66,77.47 55.88,77.47 55.88,83.82 49.53,83.82 49.53,90.17 | L9.P$3 62.54,90.17 49.53,90.17 | 49.53,90.17 C14.P$1 | Q5.3 77.47,60.79 77.47,57.15 | 77.47,57.15 80.01,57.15 C16.1 | 73.66,57.15 77.47,57.15
N$47
  Top 0.406: Q5.1 82.13,58.59 R19.1
N$48
  Top 0.406: R21.2 102.87,50.8 C17.+ 100.33,50.8 100.33,41.91 96.52,41.91 R22.2 96.52,40.64 81.28,40.64 R20.1
N$49
  Top 0.406: U1(TA).4 69.98,18.41 R2(TA).2 R3(TA).2
N$50  (via drill 0.6)
  other vias: 207.01,31.75
N$51
  Top 0.406: U8(PG).2 127,53.34 125.73,53.34 R21(PG).2 125.73,50.8 R23(PG).2
N$52
  Top 0.406: R20(PG).1 110.07,53.34 C9(PG).1
N$53
  Top 0.406: Q5.2 84.77,52.05 C18.- 87.63,52.07 | 87.63,52.07 87.63,52.05 | 87.63,52.07 88.05,52.07 88.05,50.8 | 88.05,50.8 R18.2 R40.2 | C17.- 88.05,50.8
N$54
  Top 0.406: C1(HA).1 227.42,13.75 R2(HA).1 236.86,13.2 R1(HA).2 237.49,12.57 237.49,8.25 U1(HA).2
N$55
  Top 0.406: R21(PG).1 125.31,48.68 C10(PG).1
N$56
  Top 0.406: U1(HA).6 223.52,9.52 223.52,15.24 225.21,15.24 C1(HA).2 227.42,15.45 R2(HA).2 230.5,16 R3(HA).1 R4(HA).1
N$57  (via drill 0.6)
  other vias: 200.03,32.38
N$58  (via drill 0.6)
  other vias: 135.89,81.28
N$59
  Top 0.406: U8(PG).3 128.27,53.34 130.81,53.34 U8(PG).5
N$60
  Top 0.406: Q2(PG).P$3 135.89,50.8 R30(PG).1 132.08,50.8 U8(PG).6
N$61
  Top 0.406: U3(PG).15 105.94,72.03 U2(PG).11
N$62
  Top 0.406: Q2(PG).P$1 134.62,46.72 134.62,48.26 R27(PG).1 131.66,48.26 R28(PG).2
N$63
  Top 0.406: Q2(PG).P$4 135.89,44.45 136.89,44.45 Q2(PG).P$5 139.57,44.72 R29(PG).1
N$64
  Top 0.406: R26(PG).2 136.89,49.53 Q2(PG).P$2
N$65
  Top 0.406: U8(PG).4 129.54,58.42 132.08,58.42 U8(PG).9 U8(PG).8
N$66
  Top 0.406: R24(PG).1 130.81,66.04 U8(PG).10
N$67  (via drill 0.6)
  other vias: 147.32,74.93
N$68
  Top 0.406: U2(PG).13 106.68,74.93 106.68,73.98 | U2(PG).12 106.68,73.66 106.68,73.98 | U3(PG).12 106.68,73.98
N$69
  Top 0.406: U1(PG).3 102.87,85.72 R1(PG).2 97.92,86.78 C1(PG).2
N$70
  Top 0.406: U1(PG).16 119.55,88.27 Q1(PG).3
N$71
  Top 0.406: U1(PG).4 106.68,84.45 106.68,85.09 100.97,85.09 R2(PG).2
N$72
  Top 0.406: U1(PG).1 107.53,88.27 R3(PG).1
N$73
  Top 0.406: 132.08,90.59 131.66,90.59 R13(PG).2 | 132.08,90.59 R12(PG).1 | U1(PG).14 120.65,85.72 120.65,91.44 132.08,91.44 132.08,90.59
N$74
  Top 0.406: 129.54,82.55 R10(PG).2 | 129.54,82.55 121.92,82.55 C5(PG).1 121.92,83.19 U1(PG).12 | 129.54,82.55 133.35,82.55 133.35,85.72 U4(PG).3
N$75
  Top 0.406: U2(PG).1 U2(PG).2 | U2(PG).1 97.79,76.2 R5(PG).1 | U2(PG).1 100.75,76.2 R4(PG).2
N$76
  Top 0.406: U1(PG).5 104.14,83.19 C2(PG).1 102.87,83.4 102.87,78.74 R4(PG).1
N$77
  Top 0.406: U2(PG).9 109.86,69.85 109.86,69.22 111.12,69.22 111.12,69.85 114.3,69.85 114.3,64.77 91.44,64.77 91.44,75.56 92.71,75.56 C3(PG).1 91.86,75.78 R6(PG).1
N$78
  Top 0.406: U2(PG).8 109.22,68.58 109.22,66.67 | 109.22,66.67 113.03,66.67 R7(PG).1 | C4(PG).1 109.22,66.04 109.22,66.67
N$79
  Top 0.406: U3(PG).2 121.92,72.03 121.92,70.48 123.19,70.48 R8(PG).2
N$80  (via drill 0.6)
  other vias: 147.32,91.44
N$81
  Top 0.406: R10(PG).1 130.81,80.43 130.81,77.47 U5(PG).2 | U5(PG).2 139.7,77.47 | U5(PG).2 138.43,77.47 138.43,76.2 U5(PG).3
N$82
  Top 0.406: U3(PG).1 120.65,71.38 120.65,68.58 125.73,68.58 R9(PG).2
N$83
  Top 0.406: 149.86,84.45 U4(PG).5 | 149.86,84.45 153.67,84.45 C6(PG).1 | U5(PG).10 146.05,73.66 146.05,72.39 U5(PG).9 | 149.86,84.45 149.86,72.39 U5(PG).9 | 144.78,72.39 U5(PG).9
N$84  (via drill 0.6)
  Top 0.406: v147.32,74.93 U5(PG).11 | U5(PG).8 151.13,71.12 v151.13,74.93 158.75,74.93 R11(PG).1
  Bottom 0.406: v151.13,74.93 v147.32,74.93
N$85  (via drill 0.6)
  Top 0.406: Q1(PG).2 123.19,89.85 123.19,90.17 v124.46,90.17 | R8(PG).1 123.19,73.66 v124.46,73.66 124.46,72.39 125.73,72.39 R9(PG).1
  Bottom 0.406: v124.46,73.66 v124.46,90.17
N$86
  Top 0.406: U5(PG).13 142.24,77.47 142.24,74.93 140.97,74.93 140.97,73.66 U5(PG).5 135.89,73.66 135.89,74.93 127,74.93 127,76.2 120.65,76.2 120.65,75.28 U3(PG).7
N$87  (via drill 0.6)
  Top 0.406: C8(PG).1 121.92,33.02 U6(PG).2 | C8(PG).1 R17(PG).1 | v146.05,31.11 Q6(PG).P$3 | v121.92,31.11 C8(PG).1
  Bottom 0.406: v121.92,31.11 123.19,31.11 123.19,37.46 146.05,37.46 v146.05,31.11
N$88  (via drill 0.6)
  Top 0.406: U4(PG).7 U4(PG).6 v147.32,85.72 | v115.57,34.29 118.11,34.29 R17(PG).2
  Bottom 0.406: v147.32,85.72 147.32,80.01 132.08,80.01 132.08,68.58 127,68.58 127,64.77 120.65,64.77 120.65,53.34 134.62,53.34 134.62,43.18 113.03,43.18 113.03,34.29 v115.57,34.29
N$89
  Top 0.406: U5(PG).12 143.51,76.2 143.51,73.66 142.24,73.66 142.24,72.39 U5(PG).6 128.27,72.39 128.27,73.66 125.73,73.66 125.73,74.93 121.29,74.93 121.29,72.69 U3(PG).3
N$90
  Top 0.406: P2(PG).2 R31(PG).1
N$91  (via drill 0.6)
  other vias: 137.16,78.74
N$92  (via drill 0.6)
  other vias: 137.16,76.2
N$93
  Top 0.406: R18(PG).1 P1(PG).3 123.19,20.95 P1(PG).2
N$94
  Top 0.406: Q6(PG).P$4 Q6(PG).P$5 138.85,30.11 R15(PG).1
N$95  (via drill 0.6)
  Top 0.406: U6(PG).7 134.62,33.02 C7(PG).2 v134.62,36.19 | D2(PG).A R15(PG).2 140.97,27.3 v140.97,24.76
  Bottom 0.406: v134.62,36.19 135.89,36.19 135.89,24.76 v140.97,24.76
N$96
  Top 0.406: U6(PG).6 134.62,31.75 C7(PG).1 134.62,32.11 Q6(PG).P$6 138.7,37.46 D2(PG).C 143.51,40 149.86,40 R14(PG).1
N$97
  Top 0.406: R18(PG).2 132.93,21.02 R16(PG).1 135.89,20.95 R31(PG).2 139.7,20.95 139.7,22.22 146.05,22.22 146.05,29.84 140.7,29.84 Q6(PG).P$2
N$98  (via drill 0.6)
  other vias: 110.49,73.03
N$99  (via drill 0.6)
  Top 0.406: P1(PG).1 R19(PG).1 | U6(PG).1 121.92,34.29 C8(PG).2 v121.92,37.46
  Bottom 0.406: v121.92,37.46 120.65,37.46 P1(PG).1
N$100  (via drill 0.6)
  other vias: 110.49,70.48
N$101  (via drill 0.6)
  other vias: 99.06,85.09
N$102  (via drill 0.6)
  other vias: 204.47,46.99
N$103  (via drill 0.6)
  other vias: 196.85,20.32
N$104  (via drill 0.6)
  other vias: 110.49,67.94
N$105  (via drill 0.6)
  other vias: 193.04,20.32
N$106  (via drill 0.6)
  other vias: 166.37,25.4
N$108  (via drill 0.6)
  other vias: 233.05,9.52
N$109  (via drill 0.6)
  other vias: 240.03,10.16
N$110  (via drill 0.6)
  other vias: 194.31,5.08
N$111  (via drill 0.6)
  other vias: 96.52,11.43
N$112  (via drill 0.6)
  other vias: 71.12,26.67
N$113  (via drill 0.6)
  other vias: 179.07,11.43
N$114  (via drill 0.6)
  other vias: 166.37,21.59
N$115  (via drill 0.6)
  other vias: 162.56,12.7
N$116  (via drill 0.6)
  other vias: 156.21,15.24
N$117  (via drill 0.6)
  other vias: 163.83,33.02
N$118  (via drill 0.6)
  other vias: 102.87,43.18
N$120  (via drill 0.6)
  other vias: 140.97,34.29
N$121  (via drill 0.6)
  other vias: 193.04,41.91
N$122  (via drill 0.6)
  other vias: 132.08,13.97
N$123  (via drill 0.6)
  other vias: 160.02,41.91
N$124  (via drill 0.6)
  other vias: 162.56,41.91
PE  (via drill 0.6)
  Top 0.406: C28.2 207.01,26.03 v207.01,25.4 | C6(PG).2 151.13,82.97 v151.13,82.55 | 139.17,82.55 v148.59,82.55 | 139.17,82.55 U5(PG).1 v137.16,78.74 | Q1(PG).1 121.75,87.63 | 139.17,82.55 v134.62,82.55 | v137.16,76.2 v137.16,74.93 U5(PG).4 | U3(PG).13 116.84,73.33 116.84,75.94 U3(PG).8 | R1.1 223.52,68.16 v223.52,62.23 | R4.1 223.52,57.15 v223.52,59.69 | v204.47,52.07 R8.1 | v207.01,31.75 C27.1 | v204.47,46.99 207.01,46.99 v207.01,39.37 | C21.2 v224.79,49.53 | v233.05,9.52 U1(HA).3 | C1(VC).2 87.63,20.74 v87.63,26.67 | v71.12,26.67 69.85,26.67 R3(TA).1 | R24.1 v175.26,16.51 | v175.26,11.43 D4.C | v66.04,69.85 R17.1 | v63.5,55.88 R15.1 | v102.87,43.18 R21.1 | C18.+ 91.44,57.13 v91.44,57.15 | 166.37,27.09 166.37,26.67 | 166.37,27.09 R26.1 | 166.37,27.09 166.37,31.75 171.45,31.75 v171.45,33.02 | R34.1 172.72,43.18 v171.45,43.18 | Q6(PG).P$1 140.97,32.11 v140.97,34.29 | R28(PG).1 130.18,44.45 v130.18,46.35 | R25(PG).2 138.43,66.04 v138.43,68.58 | C2(PG).2 106.68,81.7 v106.68,81.28 | R2(PG).1 99.06,81.7 v99.06,85.09
  Bottom 0.406: v207.01,25.4 v207.01,31.75 v207.01,39.37 | v148.59,82.55 v151.13,82.55 | v137.16,76.2 v137.16,78.74 | v223.52,59.69 v223.52,62.23 | v204.47,46.99 v204.47,52.07 | v224.79,49.53 v224.79,54.61 | v233.05,9.52 233.68,9.52 v233.68,2.54 | v87.63,26.67 v71.12,26.67 | v175.26,16.51 v175.26,11.43 | v63.5,55.88 66.04,55.88 v66.04,69.85 | v91.44,57.15 91.44,43.18 v102.87,43.18 102.87,44.45 127,44.45 127,46.35 v130.18,46.35 | v171.45,33.02 v171.45,43.18 | v140.97,34.29 140.97,36.83 v129.54,36.83 129.54,8.19 R16(PG).2 | v134.62,82.55 134.62,83.82 125.73,83.82 D1(PG).A | v137.16,74.93 137.16,68.58 v138.43,68.58 | v99.06,85.09 99.06,81.28 v106.68,81.28
  pour Top (isolate 0.4): 0,101.6 0,0 304.8,0 304.8,101.6
PITCH  (via drill 0.6)
  Top 0.406: JP4.3 170.18,3.81 165.1,3.81 165.1,7.62 v162.56,7.62 | v162.56,12.7 114.72,12.7 R19(PG).2
  Bottom 0.406: v162.56,12.7 v162.56,7.62
TUNER
  Top 0.406: 67.31,17.14 U1(TA).5 | R1(TA).2 67.31,24.13 67.31,22.86 66.68,22.86 66.68,21.8 C1(TA).2 67.31,21.59 67.31,17.14 | JP2.6 161.29,7.62 139.7,7.62 139.7,5.08 67.31,5.08 67.31,17.14
VCA  (via drill 0.6)
  Top 0.406: 199.39,26.03 199.39,28.57 v198.12,28.57 U3.12 | 199.39,26.03 C28.1 | 199.39,26.03 199.39,15.24 D5.C | R30.1 184.15,36.83 v184.15,38.1 | v175.9,9.52 107.95,9.52 107.95,8.89 v96.52,8.89 | v96.52,11.43 R3(VC).2
  Bottom 0.406: v198.12,28.57 197.49,28.57 197.49,38.1 v184.15,38.1 | D5.C 200.66,13.97 191.77,13.97 191.77,2.54 JP3.5 182.88,3.81 175.9,3.81 v175.9,9.52 | v96.52,8.89 v96.52,11.43
  other vias: 200.66,15.24
VCV  (via drill 0.6)
  Top 0.406: R4(VC).1 100.33,29.21 114.3,29.21 v114.3,40.64 | R26(PG).1 139.7,49.53 v139.7,46.99 | v154.94,21.59 v154.94,17.78
  Bottom 0.406: v114.3,40.64 139.7,40.64 v139.7,46.99 149.86,46.99 149.86,39.37 154.94,39.37 v154.94,21.59 | v154.94,17.78 167.64,17.78 JP4.2
VDD  (via drill 0.6)
  Top 0.406: v147.32,78.74 U5(PG).14 | U8(PG).14 v125.73,63.5 v107.95,63.5 | v107.95,76.2 U2(PG).14
  Bottom 0.406: v147.32,78.74 152.4,78.74 152.4,67.31 128.27,67.31 128.27,63.5 v125.73,63.5 | v107.95,63.5 v107.95,76.2
VSS  (via drill 0.6)
  Top 0.406: U8(PG).7 133.35,54.61 139.7,54.61 139.7,71.12 U5(PG).7 129.54,71.12 129.54,67.31 119.38,67.31 119.38,64.77 v115.57,64.77 | v97.79,68.58 U2(PG).7
  Bottom 0.406: v97.79,68.58 97.79,64.77 v115.57,64.77

### Text on the board
Reference: Negative Power | Volume Oscilator | Audio Cycle Timing Counter | Period Voltage | Sample and Hold | Variable Pitch Oscillator | Pitch Tuner | Fixed Pitch Oscillator | Volume Tuning | Gate | Voltage Controlled Amplifier | Positive power | Period to Pitch | VCA Processor | Tuner Amplifier | Volume CV | +12V | Audio In | Amp In | Headphone Amplifier | V CV | +12V | VCA Out | HA out | Amp Out | HA out | -12V | Detector | From Audio Jack | -12V | -12V | TA pot | +12V